# Altium project STguitar.PrjPcb (part 1 of 2)
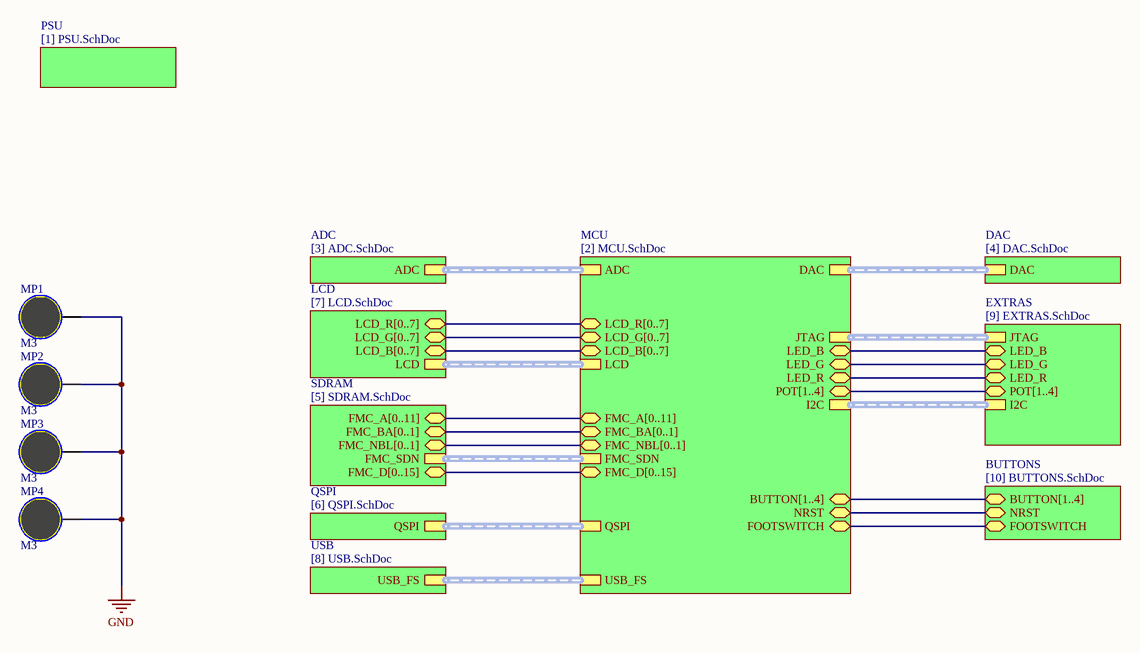
[diagram p0: [0] TOP.SchDoc]
11 sheets, 215 parts. Net scope: hierarchical (ports join the sheet entries above them; power ports are global).
Board file: STguitar.PcbDoc
Sheets:
  [0] TOP.SchDoc
    PSU = [1] PSU.SchDoc
    MCU = [2] MCU.SchDoc
    ADC = [3] ADC.SchDoc
    DAC = [4] DAC.SchDoc
    SDRAM = [5] SDRAM.SchDoc
    QSPI = [6] QSPI.SchDoc
    LCD = [7] LCD.SchDoc
    USB = [8] USB.SchDoc
    EXTRAS = [9] EXTRAS.SchDoc
    BUTTONS = [10] BUTTONS.SchDoc

## Sheet [0] TOP.SchDoc
size A4

### Parts
MP1  M3  [Mechanical screw M3]
MP2  M3  [Mechanical screw M3]
MP3  M3  [Mechanical screw M3]
MP4  M3  [Mechanical screw M3]

### Sub-sheets
ADC = [3] ADC.SchDoc: ADC (harness ADC)
BUTTONS = [10] BUTTONS.SchDoc: BUTTON[1..4] (bidir), NRST (bidir), FOOTSWITCH (bidir)
DAC = [4] DAC.SchDoc: DAC (harness DAC)
EXTRAS = [9] EXTRAS.SchDoc: JTAG (harness JTAG), LED_B (bidir), LED_G (bidir), LED_R (bidir), POT[1..4] (bidir), I2C (harness I2C)
LCD = [7] LCD.SchDoc: LCD_R[0..7] (bidir), LCD_G[0..7] (bidir), LCD_B[0..7] (bidir), LCD (harness LCD)
MCU = [2] MCU.SchDoc: BUTTON[1..4] (bidir), NRST (bidir), FOOTSWITCH (bidir), JTAG (harness JTAG), I2C (harness I2C), POT[1..4] (bidir), LED_B (bidir), LED_G (bidir), LED_R (bidir), USB_FS (harness USB), LCD (harness LCD), LCD_R[0..7] (bidir), LCD_G[0..7] (bidir), LCD_B[0..7] (bidir), QSPI (harness QSPI), FMC_NBL[0..1] (bidir), FMC_SDN (harness FMC_SDN), FMC_D[0..15] (bidir), FMC_BA[0..1] (bidir), FMC_A[0..11] (bidir), DAC (harness DAC), ADC (harness ADC)
PSU = [1] PSU.SchDoc: no entries
QSPI = [6] QSPI.SchDoc: QSPI (harness QSPI)
SDRAM = [5] SDRAM.SchDoc: FMC_A[0..11] (bidir), FMC_BA[0..1] (bidir), FMC_NBL[0..1] (bidir), FMC_SDN (harness FMC_SDN), FMC_D[0..15] (bidir)
USB = [8] USB.SchDoc: USB_FS (harness USB)

### Nets
GND: MP1.0 MP2.0 MP3.0 MP4.0
DCMI.NRST: sheet MCU/NRST, sheet BUTTONS/NRST
FOOTSWITCH: sheet MCU/FOOTSWITCH, sheet BUTTONS/FOOTSWITCH
LED_B: sheet MCU/LED_B, sheet EXTRAS/LED_B
LED_G: sheet MCU/LED_G, sheet EXTRAS/LED_G
LED_R: sheet MCU/LED_R, sheet EXTRAS/LED_R

### Buses and harness runs
bus sheet BUTTONS/BUTTON[1..4] = sheet MCU/BUTTON[1..4]
bus sheet EXTRAS/POT[1..4] = sheet MCU/POT[1..4]
bus sheet LCD/LCD_B[0..7] = sheet MCU/LCD_B[0..7]
bus sheet LCD/LCD_G[0..7] = sheet MCU/LCD_G[0..7]
bus sheet LCD/LCD_R[0..7] = sheet MCU/LCD_R[0..7]
bus sheet MCU/FMC_A[0..11] = sheet SDRAM/FMC_A[0..11]
bus sheet MCU/FMC_BA[0..1] = sheet SDRAM/FMC_BA[0..1]
bus sheet MCU/FMC_D[0..15] = sheet SDRAM/FMC_D[0..15]
bus sheet MCU/FMC_NBL[0..1] = sheet SDRAM/FMC_NBL[0..1]
harness sheet ADC/ADC = sheet MCU/ADC
harness sheet DAC/DAC = sheet MCU/DAC
harness sheet EXTRAS/I2C = sheet MCU/I2C
harness sheet EXTRAS/JTAG = sheet MCU/JTAG
harness sheet LCD/LCD = sheet MCU/LCD
harness sheet MCU/FMC_SDN = sheet SDRAM/FMC_SDN
harness sheet MCU/QSPI = sheet QSPI/QSPI
harness sheet MCU/USB_FS = sheet USB/USB_FS

### Library data of the parts
MP1-MP4 = Mechanical screw M3

## Sheet [1] PSU.SchDoc
size A4
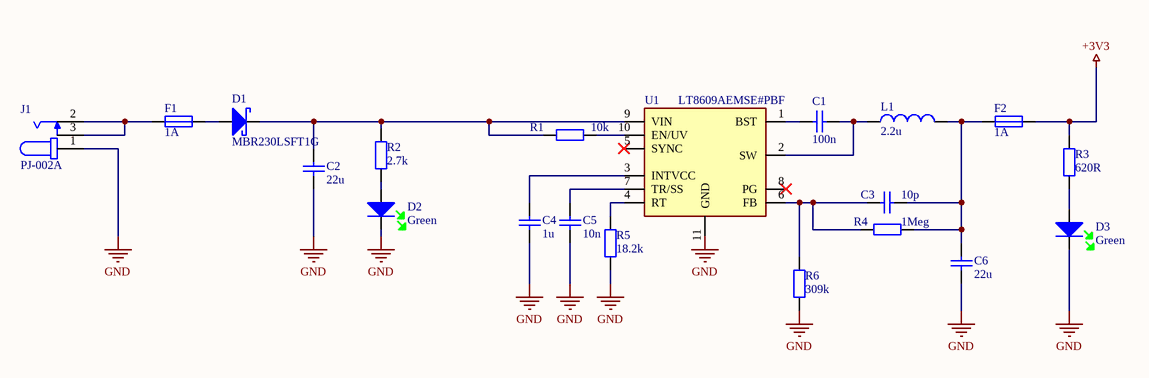
[diagram p1: [1] PSU.SchDoc]

### Parts
C1  100n  [Capacitor 0603]
C2  22u  [Capacitor 0603]
C3  10p  [Capacitor 0603]
C4  1u  [Capacitor 0603]
C5  10n  [Capacitor 0603]
C6  22u  [Capacitor 0603]
D1  MBR230LSFT1G  [Diode SOD123f]
D2  Green  [LED 0805 Green]
D3  Green  [LED 0805 Green]
F1  1A  [Fuse 1206]
F2  1A  [Fuse 1206]
J1  PJ-002A  [Mechanical CUI_PJ-002A]
L1  2.2u  [Inductor XAL50xx]
R1  10k  [Resistor 0603]
R2  2.7k  [Resistor 0603]
R3  620R  [Resistor 0603]
R4  1Meg  [Resistor 0603]
R5  18.2k  [Resistor 0603]
R6  309k  [Resistor 0603]
U1  LT8609AEMSE#PBF  [MSOP-10]

### Nets
+3V3: F2.2 R3.2
GND: C2.1 C4.1 C5.1 C6.1 D2.1 D3.1 J1.1 R5.1 R6.1 U1.11(GND)
NetC1_1: C1.1 U1.1(BST)
NetC1_2: C1.2 L1.1 U1.2(SW)
NetC2_2: C2.2 D1.2 R1.1 R2.2 U1.9(VIN)
NetC3_1: C3.1 R4.1 R6.2 U1.6(FB)
NetC3_2: C3.2 C6.2 F2.1 L1.2 R4.2
NetC4_2: C4.2 U1.3(INTVCC)
NetC5_2: C5.2 U1.7(TR/SS)
NetD1_1: D1.1 F1.2
NetD2_2: D2.2 R2.1
NetD3_2: D3.2 R3.1
NetF1_1: F1.1 J1.2 J1.3
NetR1_2: R1.2 U1.10(EN/UV)
NetR5_2: R5.2 U1.4(RT)

Not connected (* = marked no-connect by the designer): U1 5(SYNC)* 8(PG)*

### Library data of the parts
C1 = Capacitor 100n 10% 0603 EMK107B7104KA-T: Multilayer Ceramic Capacitors MLCC - SMD/SMT 0603 16VDC 0.1uF 10% X7R; Manufacturer: Taiyo Yuden; Type: SMD; Manufacturer Part Number: EMK107B7104KA-T; Footprint: 0603; Datasheet: https://pl.mouser.com/datasheet/2/396/mlcc02_e-1307760.pdf
C2 C6 = Capacitor 22u 10% 0603 CL10A226MO7JZNC: Multilayer Ceramic Capacitors MLCC - SMD/SMT 22uF+/-20% 16V X5R 1608; Manufacturer: Samsung Electro-Mechanics; Type: SMD; Manufacturer Part Number: CL10A226MO7JZNC; Footprint: 0603; Datasheet: https://pl.mouser.com/datasheet/2/585/MLCC-1837944.pdf
C3 = Capacitor 10p 10% 0603 0603YC100KAT2A: Multilayer Ceramic Capacitors MLCC - SMD/SMT 16V 10pF X7R 0603 10%; Manufacturer: AVX; Type: SMD; Manufacturer Part Number: 0603YC100KAT2A; Footprint: 0603; Datasheet: https://pl.mouser.com/datasheet/2/40/X7RDielectric-777024.pdf
C4 = Capacitor 1u 10% 0603 EMK107B7105KA-T: Multilayer Ceramic Capacitors MLCC - SMD/SMT 0603 16VDC 1uF 10% X7R; Manufacturer: Taiyo Yuden; Type: SMD; Manufacturer Part Number: EMK107B7105KA-T; Footprint: 0603; Datasheet: https://pl.mouser.com/datasheet/2/396/mlcc02_e-1307760.pdf
C5 = Capacitor 10n 10% 0603 EMK107SD103KA-T: Multilayer Ceramic Capacitors MLCC - SMD/SMT 0603 16VDC 10nF 10% Low Distort; Manufacturer: Taiyo Yuden; Type: SMD; Manufacturer Part Number: EMK107SD103KA-T; Footprint: 0603; Datasheet: https://pl.mouser.com/datasheet/2/396/mlcc02_e-1307760.pdf
D1 = Diode Schottky Diodes2A 30V SCHOTTKY MBR230LSFT1G: Schottky Diodes & Rectifiers 2A 30V SCHOTTKY; Manufacturer: ON Semiconductor / Fairchild; Type: SMD; Manufacturer Part Number: MBR230LSFT1G; Footprint: SOD-123FL-2; Datasheet: https://pl.mouser.com/datasheet/2/308/MBR230LSFT1_D-1811015.pdf
D2 D3 = Diode Standard LEDs - SMD 0805 Dome Lens LED Green- 570nm APTD2012LCGCK: Standard LEDs - SMD 0805 Dome Lens LED Green- 570nm; Manufacturer: Kingbright; Manufacturer Part Number: APTD2012LCGCK; Footprint: 0805; Type: SMD; Datasheet: https://pl.mouser.com/datasheet/2/216/APTD2012LCGCK-1102037.pdf
F1 F2 = Fuse 1206 SMT Fuse Fast Acting, 1A: Surface Mount Fuses 1206 SMT Fuse Fast Acting, 1A; Manufacturer Part Number: C1F 1; Manufacturer: Bel Fuse; Type: SMD; Footprint: 1206; Datasheet: https://pl.mouser.com/datasheet/2/643/ds-CP-c1f-series-1313112.pdf
J1 = Mechanical DC Power Connectors Power Jacks: DC Power Connectors Power Jacks; Manufacturer Part Number: PJ-002A; Manufacturer: https://pl.mouser.com/datasheet/2/670/pj_002a-1778764.pdf; Footprint: 2 mm x 6.5 mm; Type: THT; Datasheet: https://pl.mouser.com/datasheet/2/670/pj_002a-1778764.pdf
L1 = Inductor Fixed Inductors 2.2uH Shld 20% 9.2A 14.5mOhms AECQ2: Fixed Inductors 2.2uH Shld 20% 9.2A 14.5mOhms AECQ2; Manufacturer Part Number: XAL5030-222MEB; Manufacturer: Coilcraft; Type: SMD; Footprint: 5.28 mm x 3.1 mm x 5.48 mm; Datasheet: https://pl.mouser.com/datasheet/2/597/xal50xx-270657.pdf
R1 = Resistor 10k 1% 0603 RT0603FRE0710KL: Thin Film Resistors - SMD 10K ohm 1% 1/10W; Manufacturer: Yageo; Manufacturer Part Number: RT0603FRE0710KL; Footprint: 0603; Type: SMD; Datasheet: https://pl.mouser.com/datasheet/2/447/PYu_RT_1_to_0_01_RoHS_L_11-1669912.pdf
R2 = Resistor 2.7k 1% 0603 RT0603FRE072K7L: Thin Film Resistors - SMD 1/10W 2.7K ohm 1% 50ppm; Manufacturer: Yageo; Manufacturer Part Number: RT0603FRE072K7L; Footprint: 0603; Type: SMD; Datasheet: https://pl.mouser.com/datasheet/2/447/PYu_RT_1_to_0_01_RoHS_L_11-1669912.pdf
R3 = Resistor 620R 1% 0603 RT0603FRE07620RL: Thin Film Resistors - SMD 620 OHM 1% 50PPM 1/10W; Manufacturer: Yageo; Manufacturer Part Number: RT0603FRE07620RL; Footprint: 0603; Type: SMD; Datasheet: https://pl.mouser.com/datasheet/2/447/PYu_RT_1_to_0_01_RoHS_L_11-1669912.pdf
R4 = Resistor 1Meg 1% 0603 RT0603FRE071ML: Thin Film Resistors - SMD 1M OHM 1% 50PPM 1/10W; Manufacturer: Yageo; Manufacturer Part Number: RT0603FRE071ML; Footprint: 0603; Type: SMD; Datasheet: https://pl.mouser.com/datasheet/2/447/PYu_RT_1_to_0_01_RoHS_L_11-1669912.pdf
R5 = Resistor 18.2k 1% 0603 RT0603FRE0718K2L: Thin Film Resistors - SMD 1/10W 18.2K ohm 1% 50ppm; Manufacturer: Yageo; Manufacturer Part Number: RT0603FRE0718K2L; Footprint: 0603; Type: SMD; Datasheet: https://pl.mouser.com/datasheet/2/447/PYu_RT_1_to_0_01_RoHS_L_11-1669912.pdf
R6 = Resistor 309k 1% 0603 RT0603FRE07309KL: Thin Film Resistors - SMD 1/10W 309K ohm 1% 50ppm; Manufacturer: Yageo; Manufacturer Part Number: RT0603FRE07309KL; Footprint: 0603; Type: SMD; Datasheet: https://pl.mouser.com/datasheet/2/447/PYu_RT_1_to_0_01_RoHS_L_11-1669912.pdf
U1 = IC Switching Voltage Regulators 42V, 2A/3A Peak Sync Buck Reg w/ 2.5uA LT8609AEMSE#PBF: Switching Voltage Regulators 42V, 2A Synchronous Step-Down Regulator with 2.5uA Quiescent Current; Manufacturer: Analog Devices; Manufacturer Part Number: LT8609AEMSE#PBF; Type: SMD; Datasheet: https://pl.mouser.com/datasheet/2/609/LT8609_8609A_8609B-1551398.pdf

## Sheet [2] MCU.SchDoc
size A3
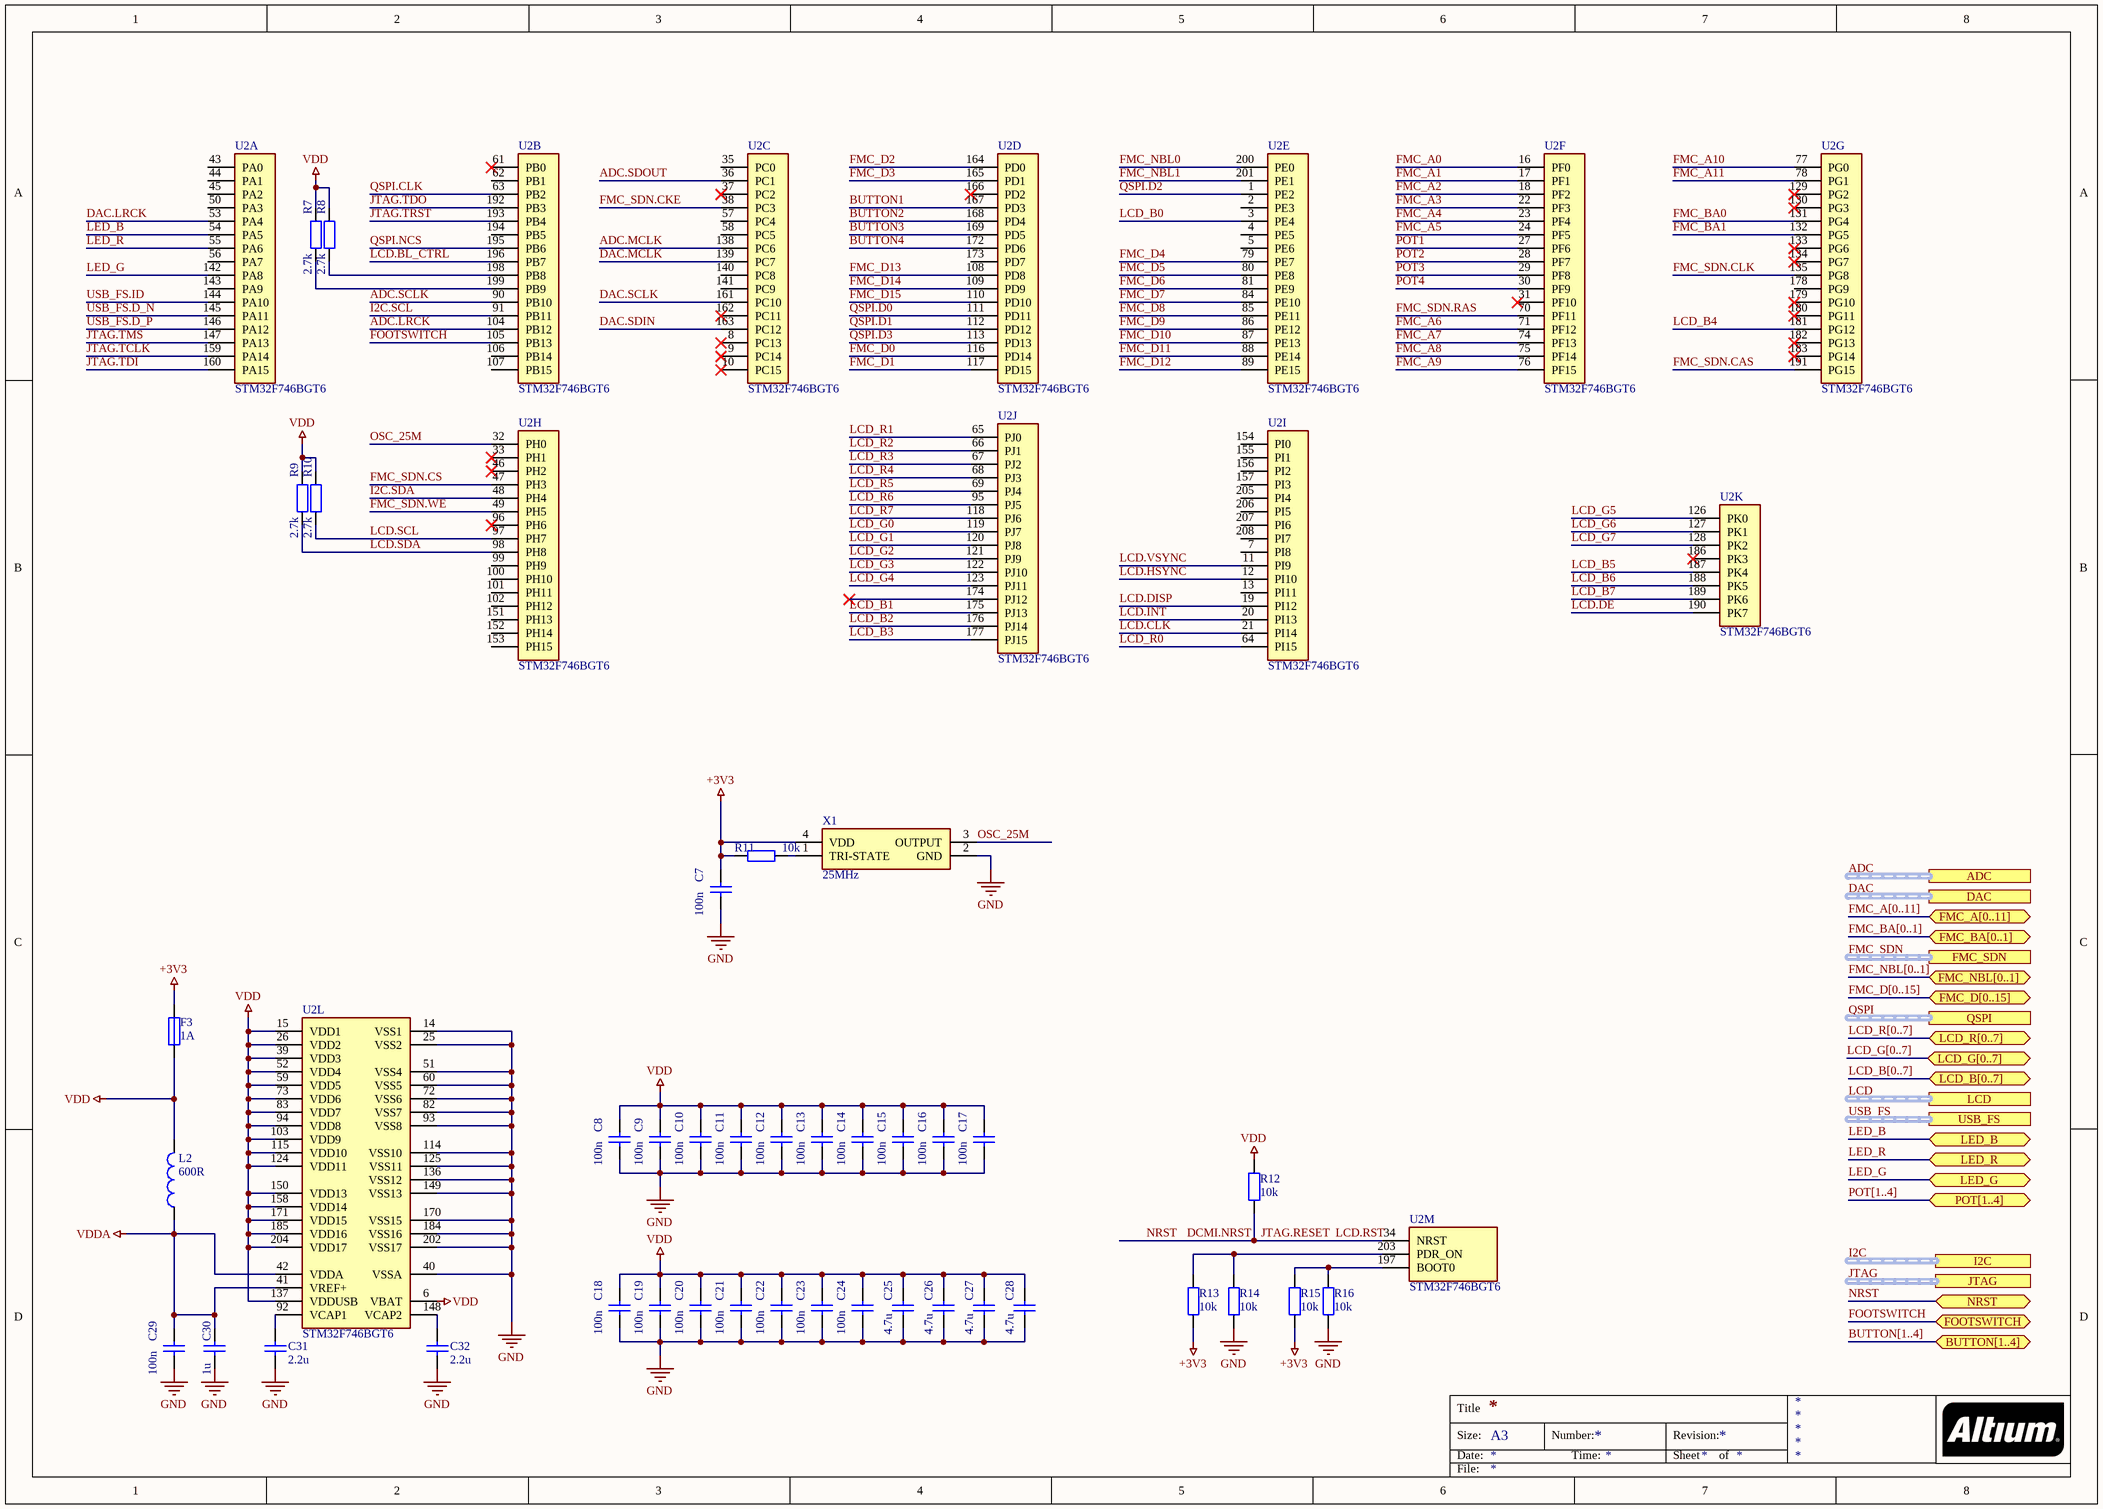
[diagram p2: [2] MCU.SchDoc]

### Parts
C7  100n  [Capacitor 0603]
C8  100n  [Capacitor 0603]
C9  100n  [Capacitor 0603]
C10  100n  [Capacitor 0603]
C11  100n  [Capacitor 0603]
C12  100n  [Capacitor 0603]
C13  100n  [Capacitor 0603]
C14  100n  [Capacitor 0603]
C15  100n  [Capacitor 0603]
C16  100n  [Capacitor 0603]
C17  100n  [Capacitor 0603]
C18  100n  [Capacitor 0603]
C19  100n  [Capacitor 0603]
C20  100n  [Capacitor 0603]
C21  100n  [Capacitor 0603]
C22  100n  [Capacitor 0603]
C23  100n  [Capacitor 0603]
C24  100n  [Capacitor 0603]
C25  4.7u  [Capacitor 0603]
C26  4.7u  [Capacitor 0603]
C27  4.7u  [Capacitor 0603]
C28  4.7u  [Capacitor 0603]
C29  100n  [Capacitor 0603]
C30  1u  [Capacitor 0603]
C31  2.2u  [Capacitor 0603]
C32  2.2u  [Capacitor 0603]
F3  1A  [Fuse 1206]
L2  600R  [Inductor 0603]
R7  2.7k  [Resistor 0603]
R8  2.7k  [Resistor 0603]
R9  2.7k  [Resistor 0603]
R10  2.7k  [Resistor 0603]
R11  10k  [Resistor 0603]
R12  10k  [Resistor 0603]
R13  10k  [Resistor 0603]
R14  10k  [Resistor 0603]
R15  10k  [Resistor 0603]
R16  10k  [Resistor 0603]
U2  STM32F746BGT6  [TQFP208]  (parts A,B,C,D,E,F,G,H,I,J,K,L,M of 13)
X1  25MHz  [Crystal 25MHz]

### Ports
ADC (harness ADC), BUTTON[1..4] (bidir), DAC (harness DAC), FMC_A[0..11] (bidir), FMC_BA[0..1] (bidir), FMC_D[0..15] (bidir), FMC_NBL[0..1] (bidir), FMC_SDN (harness FMC_SDN), FOOTSWITCH (bidir), I2C (harness I2C), JTAG (harness JTAG), LCD (harness LCD), LCD_B[0..7] (bidir), LCD_G[0..7] (bidir), LCD_R[0..7] (bidir), LED_B (bidir), LED_G (bidir), LED_R (bidir), NRST (bidir), POT[1..4] (bidir), QSPI (harness QSPI), USB_FS (harness USB)

### Nets
+3V3: C7.2 F3.2 R11.2 R13.1 R15.1 X1.4(VDD)
GND: C7.1 C8.1 C9.1 C10.1 C11.1 C12.1 C13.1 C14.1 C15.1 C16.1 C17.1 C18.1 C19.1 C20.1 C21.1 C22.1 C23.1 C24.1 C25.1 C26.1 C27.1 C28.1 C29.1 C30.1 C31.1 C32.1 R14.1 R16.1 U2.14(VSS1) U2.25(VSS2) U2.40(VSSA) U2.51(VSS4) U2.60(VSS5) U2.72(VSS6) U2.82(VSS7) U2.93(VSS8) U2.114(VSS10) U2.125(VSS11) U2.136(VSS12) U2.149(VSS13) U2.170(VSS15) U2.184(VSS16) U2.202(VSS17) X1.2(GND)
VDD: C8.2 C9.2 C10.2 C11.2 C12.2 C13.2 C14.2 C15.2 C16.2 C17.2 C18.2 C19.2 C20.2 C21.2 C22.2 C23.2 C24.2 C25.2 C26.2 C27.2 C28.2 F3.1 L2.2 R7.2 R8.2 R9.2 R10.2 R12.2 U2.6(VBAT) U2.15(VDD1) U2.26(VDD2) U2.39(VDD3) U2.52(VDD4) U2.59(VDD5) U2.73(VDD6) U2.83(VDD7) U2.94(VDD8) U2.103(VDD9) U2.115(VDD10) U2.124(VDD11) U2.137(VDDUSB) U2.150(VDD13) U2.158(VDD14) U2.171(VDD15) U2.185(VDD16) U2.204(VDD17)
VDDA: C29.2 C30.2 L2.1 U2.41(VREF+) U2.42(VDDA)
ADC.LRCK: U2.104(PB12)
ADC.MCLK: U2.138(PC6)
ADC.SCLK: U2.90(PB10)
ADC.SDOUT: U2.36(PC1)
BUTTON1: U2.167(PD3)
BUTTON2: U2.168(PD4)
BUTTON3: U2.169(PD5)
BUTTON4: U2.172(PD6)
DAC.LRCK: U2.53(PA4)
DAC.MCLK: U2.139(PC7)
DAC.SCLK: U2.161(PC10)
DAC.SDIN: U2.163(PC12)
DCMI.NRST: R12.1 U2.34(NRST) ; port NRST  [also labelled JTAG.RESET, LCD.RST, NRST]
FMC_A0: U2.16(PF0)
FMC_A1: U2.17(PF1)
FMC_A2: U2.18(PF2)
FMC_A3: U2.22(PF3)
FMC_A4: U2.23(PF4)
FMC_A5: U2.24(PF5)
FMC_A6: U2.71(PF12)
FMC_A7: U2.74(PF13)
FMC_A8: U2.75(PF14)
FMC_A9: U2.76(PF15)
FMC_A10: U2.77(PG0)
FMC_A11: U2.78(PG1)
FMC_BA0: U2.131(PG4)
FMC_BA1: U2.132(PG5)
FMC_D0: U2.116(PD14)
FMC_D1: U2.117(PD15)
FMC_D2: U2.164(PD0)
FMC_D3: U2.165(PD1)
FMC_D4: U2.79(PE7)
FMC_D5: U2.80(PE8)
FMC_D6: U2.81(PE9)
FMC_D7: U2.84(PE10)
FMC_D8: U2.85(PE11)
FMC_D9: U2.86(PE12)
FMC_D10: U2.87(PE13)
FMC_D11: U2.88(PE14)
FMC_D12: U2.89(PE15)
FMC_D13: U2.108(PD8)
FMC_D14: U2.109(PD9)
FMC_D15: U2.110(PD10)
FMC_NBL0: U2.200(PE0)
FMC_NBL1: U2.201(PE1)
FMC_SDN.CAS: U2.191(PG15)
FMC_SDN.CKE: U2.38(PC3)
FMC_SDN.CLK: U2.135(PG8)
FMC_SDN.CS: U2.47(PH3)
FMC_SDN.RAS: U2.70(PF11)
FMC_SDN.WE: U2.49(PH5)
FOOTSWITCH: U2.105(PB13) ; port FOOTSWITCH
I2C.SCL: U2.91(PB11)
I2C.SDA: U2.48(PH4)
JTAG.TCLK: U2.159(PA14)
JTAG.TDI: U2.160(PA15)
JTAG.TDO: U2.192(PB3)
JTAG.TMS: U2.147(PA13)
JTAG.TRST: U2.193(PB4)
LCD.BL_CTRL: U2.196(PB7)
LCD.CLK: U2.21(PI14)
LCD.DE: U2.190(PK7)
LCD.DISP: U2.19(PI12)
LCD.HSYNC: U2.12(PI10)
LCD.INT: U2.20(PI13)
LCD.SCL: R10.1 U2.97(PH7)
LCD.SDA: R9.1 U2.98(PH8)
LCD.VSYNC: U2.11(PI9)
LCD_B0: U2.3(PE4)
LCD_B1: U2.175(PJ13)
LCD_B2: U2.176(PJ14)
LCD_B3: U2.177(PJ15)
LCD_B4: U2.181(PG12)
LCD_B5: U2.187(PK4)
LCD_B6: U2.188(PK5)
LCD_B7: U2.189(PK6)
LCD_G0: U2.119(PJ7)
LCD_G1: U2.120(PJ8)
LCD_G2: U2.121(PJ9)
LCD_G3: U2.122(PJ10)
LCD_G4: U2.123(PJ11)
LCD_G5: U2.126(PK0)
LCD_G6: U2.127(PK1)
LCD_G7: U2.128(PK2)
LCD_R0: U2.64(PI15)
LCD_R1: U2.65(PJ0)
LCD_R2: U2.66(PJ1)
LCD_R3: U2.67(PJ2)
LCD_R4: U2.68(PJ3)
LCD_R5: U2.69(PJ4)
LCD_R6: U2.95(PJ5)
LCD_R7: U2.118(PJ6)
LED_B: U2.54(PA5) ; port LED_B
LED_G: U2.142(PA8) ; port LED_G
LED_R: U2.55(PA6) ; port LED_R
OSC_25M: U2.32(PH0) X1.3(OUTPUT)
POT1: U2.27(PF6)
POT2: U2.28(PF7)
POT3: U2.29(PF8)
POT4: U2.30(PF9)
QSPI.CLK: U2.63(PB2)
QSPI.D0: U2.111(PD11)
QSPI.D1: U2.112(PD12)
QSPI.D2: U2.1(PE2)
QSPI.D3: U2.113(PD13)
QSPI.NCS: U2.195(PB6)
USB_FS.D_N: U2.145(PA11)
USB_FS.D_P: U2.146(PA12)
USB_FS.ID: U2.144(PA10)
NetC31_2: C31.2 U2.92(VCAP1)
NetC32_2: C32.2 U2.148(VCAP2)
NetR7_1: R7.1 U2.199(PB9)
NetR8_1: R8.1 U2.198(PB8)
NetR11_1: R11.1 X1.1(TRI-STATE)
NetR13_2: R13.2 R14.2 U2.203(PDR_ON)
NetR15_2: R15.2 R16.2 U2.197(BOOT0)

Not connected (* = marked no-connect by the designer): U2 2(PE3) 4(PE5) 5(PE6) 7(PI8) 8(PC13)* 9(PC14)* 10(PC15)* 13(PI11) 31(PF10)* 33(PH1)* 35(PC0) 37(PC2)* 43(PA0) 44(PA1) 45(PA2) 46(PH2)* 50(PA3) 56(PA7) 57(PC4) 58(PC5) 61(PB0)* 62(PB1) 96(PH6)* 99(PH9) 100(PH10) 101(PH11) 102(PH12) 106(PB14) 107(PB15) 129(PG2)* 130(PG3)* 133(PG6)* 134(PG7)* 140(PC8) 141(PC9) 143(PA9) 151(PH13) 152(PH14) 153(PH15) 154(PI0) 155(PI1) 156(PI2) 157(PI3) 162(PC11)* 166(PD2)* 173(PD7) 174(PJ12)* 178(PG9) 179(PG10)* 180(PG11)* 182(PG13)* 183(PG14)* 186(PK3)* 194(PB5) 205(PI4) 206(PI5) 207(PI6) 208(PI7)

### Buses and harness runs
bus BUTTON[1..4] = port BUTTON[1..4]
bus FMC_A[0..11] = port FMC_A[0..11]
bus FMC_BA[0..1] = port FMC_BA[0..1]
bus FMC_D[0..15] = port FMC_D[0..15]
bus FMC_NBL[0..1] = port FMC_NBL[0..1]
bus LCD_B[0..7] = port LCD_B[0..7]
bus LCD_G[0..7] = port LCD_G[0..7]
bus LCD_R[0..7] = port LCD_R[0..7]
bus POT[1..4] = port POT[1..4]
harness ADC = port ADC
harness DAC = port DAC
harness FMC_SDN = port FMC_SDN
harness I2C = port I2C
harness JTAG = port JTAG
harness LCD = port LCD
harness QSPI = port QSPI
harness USB_FS = port USB_FS

### Notes on the sheet
- Title
- Size:
- Date:
- A3
- Number:
- Time:
- Revision:
- Sheet
- of
- File:

### Library data of the parts
C7-C24 C29 = Capacitor 100n 10% 0603 EMK107B7104KA-T: as C1 on sheet [1] PSU; Manufacturer Part Number: EMK107B7104KA-T; Footprint: 0603; Datasheet: https://pl.mouser.com/datasheet/2/396/mlcc02_e-1307760.pdf
C25-C28 = Capacitor 4.7u 10% 0603 EMK107ABJ475KA-T: Multilayer Ceramic Capacitors MLCC - SMD/SMT 0603 16VDC 4.7uF 10% X5R; Manufacturer: Taiyo Yuden; Type: SMD; Manufacturer Part Number: EMK107ABJ475KA-T; Footprint: 0603; Datasheet: https://pl.mouser.com/datasheet/2/396/mlcc02_e-1307760.pdf
C30 = Capacitor 1u 10% 0603 EMK107B7105KA-T: as C4 on sheet [1] PSU; Manufacturer Part Number: EMK107B7105KA-T; Footprint: 0603; Datasheet: https://pl.mouser.com/datasheet/2/396/mlcc02_e-1307760.pdf
C31 C32 = Capacitor 2.2u 10% 0603 EMK107BJ225KA-T: Multilayer Ceramic Capacitors MLCC - SMD/SMT 0603 16VDC 2.2uF 10% X5R; Manufacturer: Taiyo Yuden; Type: SMD; Manufacturer Part Number: EMK107BJ225KA-T; Footprint: 0603; Datasheet: https://pl.mouser.com/datasheet/2/396/mlcc02_e-1307760.pdf
F3 = Fuse 1206 SMT Fuse Fast Acting, 1A: as F1 on sheet [1] PSU; Footprint: 1206; Datasheet: https://pl.mouser.com/datasheet/2/643/ds-CP-c1f-series-1313112.pdf
L2 = Inductor 600R 1% 0603 HZ0603C601R-10: Ferrite Beads 600ohms 100MHz 300mA Monolithic 0603 SMD; Manufacturer: Laird Performance Materials; Manufacturer Part Number: HZ0603C601R-10; Footprint: 0603; Type: SMD; Datasheet: https://www.mouser.com/catalog/specsheets/Laird_10092020_Laird%20MCP%20Catalog-EMI%20Filtering%20and%20RF%20Inductor%20Sep%202020.pdf
R7-R10 = Resistor 2.7k 1% 0603 RT0603FRE072K7L: as R2 on sheet [1] PSU; Manufacturer Part Number: RT0603FRE072K7L; Footprint: 0603; Type: SMD; Datasheet: https://pl.mouser.com/datasheet/2/447/PYu_RT_1_to_0_01_RoHS_L_11-1669912.pdf
R11-R16 = Resistor 10k 1% 0603 RT0603FRE0710KL: as R1 on sheet [1] PSU; Manufacturer Part Number: RT0603FRE0710KL; Footprint: 0603; Type: SMD; Datasheet: https://pl.mouser.com/datasheet/2/447/PYu_RT_1_to_0_01_RoHS_L_11-1669912.pdf
U2 = IC MCU 32BIT 1MB FLASH 208LQFP STM32F746BGT6: MCU, 32BIT, CORTEX-M7, 216MHZ, LQFP-208; Architecture:ARM Cortex-M7; Program Memory Size:1MB; RAM Memory Size:320KB; CPU Speed:216MHz; No. of I/Os:168; MCU Case Style:LQFP; No. of Pins:208; Embedded Interface Type:CAN, Ethernet, I2C, SPI, UART, USART, USB; Supply Voltage Min:1.7V; Supply Voltage Max:3.6V; Packaging:Each; MSL:MSL 3 - 168 hours; Manufacturer: STMicroelectronics; Manufacturer Part Number: STM32F746BGT6; Footprint: LQFP-208; Type: SMD; Datasheet: https://pl.mouser.com/datasheet/2/389/dm00166116-1798632.pdf
X1 = Crystal 25MHz 2.5 mm x 2 mm DSC6101JA2B-025.0000: Standard Clock Oscillators Ultra-low Power MEMS Oscillator, 2520,-40C to+125C, 25ppm; Manufacturer: Microchip Technology; Manufacturer Part Number: DSC6101JA2B-025.0000; Footprint: 2.5 mm x 2 mm; Type: SMD; Datasheet: https://pl.mouser.com/datasheet/2/268/DSC61xxB-Ultra-Small-Ultra-Low-Power-MEMS-Oscillat-1660330.pdf

## Sheet [3] ADC.SchDoc
size A4
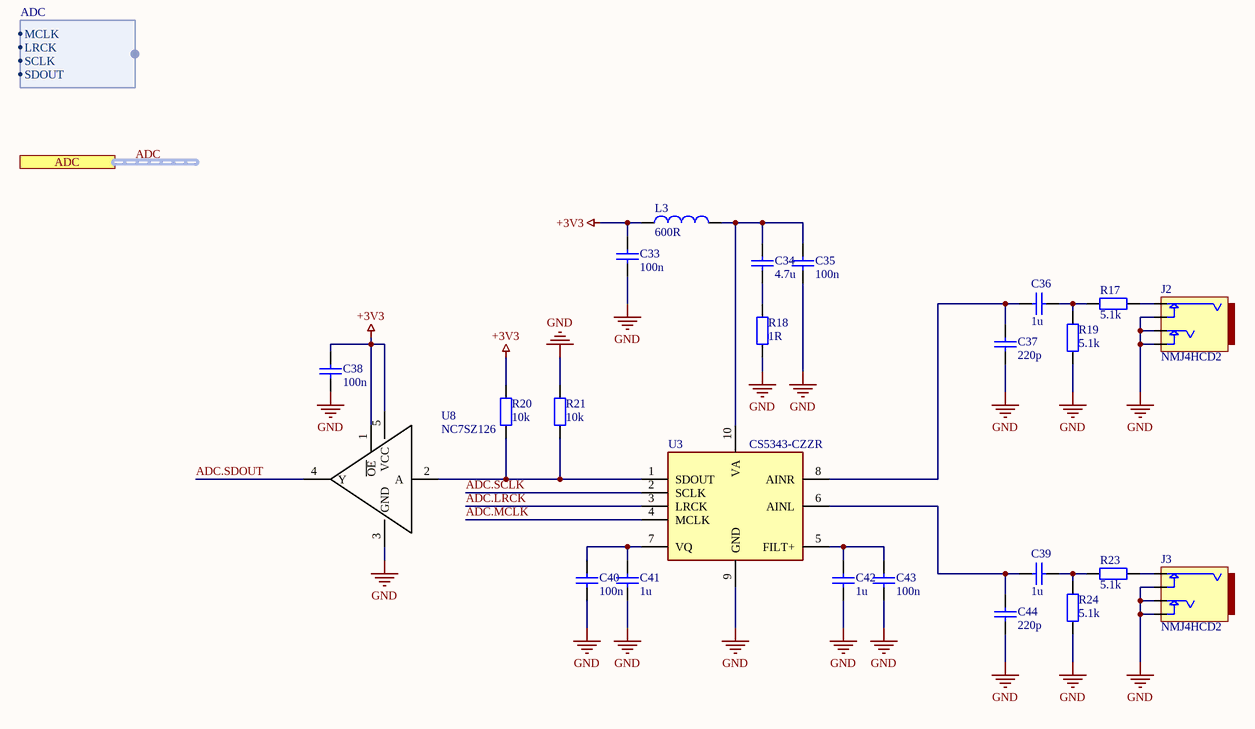
[diagram p3: [3] ADC.SchDoc]

### Parts
C33  100n  [Capacitor 0603]
C34  4.7u  [Capacitor 0603]
C35  100n  [Capacitor 0603]
C36  1u  [Capacitor 0603]
C37  220p  [Capacitor 0603]
C38  100n  [Capacitor 0603]
C39  1u  [Capacitor 0603]
C40  100n  [Capacitor 0603]
C41  1u  [Capacitor 0603]
C42  1u  [Capacitor 0603]
C43  100n  [Capacitor 0603]
C44  220p  [Capacitor 0603]
J2  NMJ4HCD2  [Mechanical NMJ4HCD2]
J3  NMJ4HCD2  [Mechanical NMJ4HCD2]
L3  600R  [Inductor 0603]
R17  5.1k  [Resistor 0603]
R18  1R  [Resistor 0603]
R19  5.1k  [Resistor 0603]
R20  10k  [Resistor 0603]
R21  10k  [Resistor 0603]
R23  5.1k  [Resistor 0603]
R24  5.1k  [Resistor 0603]
U3  CS5343-CZZR  [TSSOP10]
U8  NC7SZ126  [SC70-5]

### Ports
ADC (harness ADC)

### Harnesses
ADC: MCLK, LRCK, SCLK, SDOUT

### Nets
+3V3: C33.2 C38.2 L3.1 R20.2 U8.1(~{OE}) U8.5(VCC)
GND: C33.1 C35.1 C37.1 C38.1 C40.1 C41.1 C42.1 C43.1 C44.1 J2.1(S) J2.2(SN) J2.4(TN) J3.1(S) J3.2(SN) J3.4(TN) R18.1 R19.1 R21.2 R24.1 U3.9(GND) U8.3(GND)
ADC.LRCK: U3.3(LRCK)
ADC.MCLK: U3.4(MCLK)
ADC.SCLK: U3.2(SCLK)
ADC.SDOUT: U8.4(Y)
NetC34_1: C34.1 R18.2
NetC34_2: C34.2 C35.2 L3.2 U3.10(VA)
NetC36_1: C36.1 C37.2 U3.8(AINR)
NetC36_2: C36.2 R17.1 R19.2
NetC39_1: C39.1 C44.2 U3.6(AINL)
NetC39_2: C39.2 R23.1 R24.2
NetC40_2: C40.2 C41.2 U3.7(VQ)
NetC42_2: C42.2 C43.2 U3.5(FILT+)
NetJ2_3: J2.3(T) R17.2
NetJ3_3: J3.3(T) R23.2
NetR20_1: R20.1 R21.1 U3.1(SDOUT) U8.2(A)

### Buses and harness runs
harness ADC = port ADC

### Library data of the parts
C33 C35 C38 C40 C43 = Capacitor 100n 10% 0603 EMK107B7104KA-T: as C1 on sheet [1] PSU; Manufacturer Part Number: EMK107B7104KA-T; Footprint: 0603; Datasheet: https://pl.mouser.com/datasheet/2/396/mlcc02_e-1307760.pdf
C34 = Capacitor 4.7u 10% 0603 EMK107ABJ475KA-T: as C25 on sheet [2] MCU; Manufacturer Part Number: EMK107ABJ475KA-T; Footprint: 0603; Datasheet: https://pl.mouser.com/datasheet/2/396/mlcc02_e-1307760.pdf
C36 C39 C41 C42 = Capacitor 1u 10% 0603 EMK107B7105KA-T: as C4 on sheet [1] PSU; Manufacturer Part Number: EMK107B7105KA-T; Footprint: 0603; Datasheet: https://pl.mouser.com/datasheet/2/396/mlcc02_e-1307760.pdf
C37 C44 = Capacitor 220p 10% 0603 HMK107SD221KA-T: Multilayer Ceramic Capacitors MLCC - SMD/SMT 0603 100VDC 220pF 20% NPO MID HIGH VOL; Manufacturer: Taiyo Yuden; Type: SMD; Manufacturer Part Number: HMK107SD221KA-T; Footprint: 0603; Datasheet: https://pl.mouser.com/datasheet/2/396/mlcc06_e-1892430.pdf
J2 J3 = Mechanical JACK Phone Connectors 2C MONO 2-SPST NC: Phone Connectors 2C MONO 2-SPST NC; Manufacturer: Neutrik; Manufacturer Part Number: NMJ4HCD2; Footprint: Solder Pin; Type: THT; Datasheet: https://pl.mouser.com/datasheet/2/289/nmj4hcd2-1853956.pdf
L3 = Inductor 600R 1% 0603 HZ0603C601R-10: as L2 on sheet [2] MCU; Manufacturer Part Number: HZ0603C601R-10; Footprint: 0603; Type: SMD; Datasheet: https://www.mouser.com/catalog/specsheets/Laird_10092020_Laird%20MCP%20Catalog-EMI%20Filtering%20and%20RF%20Inductor%20Sep%202020.pdf
R17 R19 R23 R24 = Resistor 5.1k 1% 0603 RT0603FRE075K1L: Thin Film Resistors - SMD 1/10W 5.1K ohm 1% 50ppm; Manufacturer: Yageo; Manufacturer Part Number: RT0603FRE075K1L; Footprint: 0603; Type: SMD; Datasheet: https://pl.mouser.com/datasheet/2/447/PYu_RT_1_to_0_01_RoHS_L_11-1669912.pdf
R18 = Resistor 1R 1% 0603 RT0603FRE071RL: Thin Film Resistors - SMD 1/10W 1 ohm ohm 50 ppm; Manufacturer: Yageo; Manufacturer Part Number: RT0603FRE071RL; Footprint: 0603; Type: SMD; Datasheet: https://pl.mouser.com/datasheet/2/447/PYu_RT_1_to_0_01_RoHS_L_11-1669912.pdf
R20 R21 = Resistor 10k 1% 0603 RT0603FRE0710KL: as R1 on sheet [1] PSU; Manufacturer Part Number: RT0603FRE0710KL; Footprint: 0603; Type: SMD; Datasheet: https://pl.mouser.com/datasheet/2/447/PYu_RT_1_to_0_01_RoHS_L_11-1669912.pdf
U3 = IC Audio A/D Converter ICs IC 98dB 24-bit 96kHz Stereo ADC CS5343-CZZR: Audio A/D Converter ICs IC 98dB 24-bit 96kHz Stereo ADC; Manufacturer: Cirrus Logic; Manufacturer Part Number: CS5343-CZZR; Footprint: TSSOP-10; Type: SMD; Datasheet: https://pl.mouser.com/datasheet/2/76/CS5343_44_F5-1142054.pdf
U8 = IC Buffers & Line Drivers UHS Buffer NC7SZ126P5X: Buffers & Line Drivers UHS Buffer; Manufacturer: ON Semiconductor / Fairchild; Manufacturer Part Number: NC7SZ126; Footprint: SC-70-5; Type: SMD; Datasheet: https://pl.mouser.com/datasheet/2/308/NC7SZ126-D-1812272.pdf

## Sheet [4] DAC.SchDoc
size A4
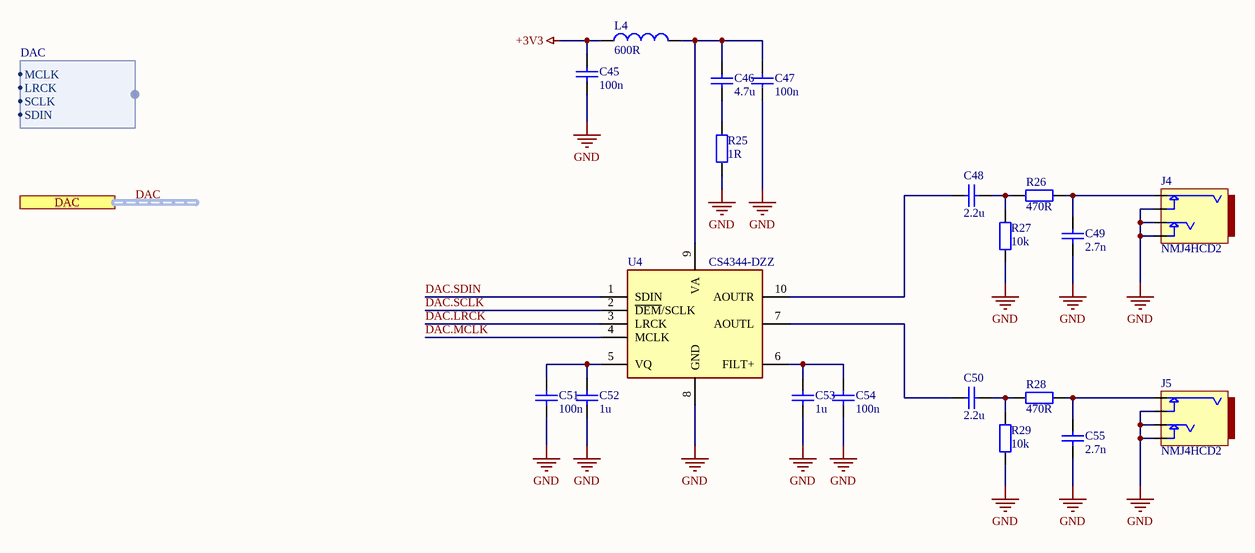
[diagram p4: [4] DAC.SchDoc]

### Parts
C45  100n  [Capacitor 0603]
C46  4.7u  [Capacitor 0603]
C47  100n  [Capacitor 0603]
C48  2.2u  [Capacitor 0603]
C49  2.7n  [Capacitor 0603]
C50  2.2u  [Capacitor 0603]
C51  100n  [Capacitor 0603]
C52  1u  [Capacitor 0603]
C53  1u  [Capacitor 0603]
C54  100n  [Capacitor 0603]
C55  2.7n  [Capacitor 0603]
J4  NMJ4HCD2  [Mechanical NMJ4HCD2]
J5  NMJ4HCD2  [Mechanical NMJ4HCD2]
L4  600R  [Inductor 0603]
R25  1R  [Resistor 0603]
R26  470R  [Resistor 0603]
R27  10k  [Resistor 0603]
R28  470R  [Resistor 0603]
R29  10k  [Resistor 0603]
U4  CS4344-DZZ  [TSSOP10]

### Ports
DAC (harness DAC)

### Harnesses
DAC: MCLK, LRCK, SCLK, SDIN

### Nets
+3V3: C45.2 L4.1
GND: C45.1 C47.1 C49.1 C51.1 C52.1 C53.1 C54.1 C55.1 J4.1(S) J4.2(SN) J4.4(TN) J5.1(S) J5.2(SN) J5.4(TN) R25.1 R27.1 R29.1 U4.8(GND)
DAC.LRCK: U4.3(LRCK)
DAC.MCLK: U4.4(MCLK)
DAC.SCLK: U4.2(~{DEM}/SCLK)
DAC.SDIN: U4.1(SDIN)
NetC46_1: C46.1 R25.2
NetC46_2: C46.2 C47.2 L4.2 U4.9(VA)
NetC48_1: C48.1 U4.10(AOUTR)
NetC48_2: C48.2 R26.1 R27.2
NetC49_2: C49.2 J4.3(T) R26.2
NetC50_1: C50.1 U4.7(AOUTL)
NetC50_2: C50.2 R28.1 R29.2
NetC51_2: C51.2 C52.2 U4.5(VQ)
NetC53_2: C53.2 C54.2 U4.6(FILT+)
NetC55_2: C55.2 J5.3(T) R28.2

### Buses and harness runs
harness DAC = port DAC

### Library data of the parts
C45 C47 C51 C54 = Capacitor 100n 10% 0603 EMK107B7104KA-T: as C1 on sheet [1] PSU; Manufacturer Part Number: EMK107B7104KA-T; Footprint: 0603; Datasheet: https://pl.mouser.com/datasheet/2/396/mlcc02_e-1307760.pdf
C46 = Capacitor 4.7u 10% 0603 EMK107ABJ475KA-T: as C25 on sheet [2] MCU; Manufacturer Part Number: EMK107ABJ475KA-T; Footprint: 0603; Datasheet: https://pl.mouser.com/datasheet/2/396/mlcc02_e-1307760.pdf
C48 C50 = Capacitor 2.2u 10% 0603 EMK107BJ225KA-T: as C31 on sheet [2] MCU; Manufacturer Part Number: EMK107BJ225KA-T; Footprint: 0603; Datasheet: https://pl.mouser.com/datasheet/2/396/mlcc02_e-1307760.pdf
C49 C55 = Capacitor 2.7n 10% 0603 UMK107SD272KA-T: Multilayer Ceramic Capacitors MLCC - SMD/SMT 0603 50VDC 2.7nF 10% Low Distort; Manufacturer: Taiyo Yuden; Type: SMD; Manufacturer Part Number: UMK107SD272KA-T; Footprint: 0603; Datasheet: https://pl.mouser.com/datasheet/2/396/mlcc02_e-1307760.pdf
C52 C53 = Capacitor 1u 10% 0603 EMK107B7105KA-T: as C4 on sheet [1] PSU; Manufacturer Part Number: EMK107B7105KA-T; Footprint: 0603; Datasheet: https://pl.mouser.com/datasheet/2/396/mlcc02_e-1307760.pdf
J4 J5 = Mechanical JACK Phone Connectors 2C MONO 2-SPST NC: as J2 on sheet [3] ADC; Manufacturer Part Number: NMJ4HCD2; Footprint: Solder Pin; Type: THT; Datasheet: https://pl.mouser.com/datasheet/2/289/nmj4hcd2-1853956.pdf
L4 = Inductor 600R 1% 0603 HZ0603C601R-10: as L2 on sheet [2] MCU; Manufacturer Part Number: HZ0603C601R-10; Footprint: 0603; Type: SMD; Datasheet: https://www.mouser.com/catalog/specsheets/Laird_10092020_Laird%20MCP%20Catalog-EMI%20Filtering%20and%20RF%20Inductor%20Sep%202020.pdf
R25 = Resistor 1R 1% 0603 RT0603FRE071RL: as R18 on sheet [3] ADC; Manufacturer Part Number: RT0603FRE071RL; Footprint: 0603; Type: SMD; Datasheet: https://pl.mouser.com/datasheet/2/447/PYu_RT_1_to_0_01_RoHS_L_11-1669912.pdf
R26 R28 = Resistor 470R 1% 0603 RT0603FRE07470RL: Thin Film Resistors - SMD 1/10W 470 ohm 1% 50ppm; Manufacturer: Yageo; Manufacturer Part Number: RT0603FRE07470RL; Footprint: 0603; Type: SMD; Datasheet: https://pl.mouser.com/datasheet/2/447/PYu_RT_1_to_0_01_RoHS_L_11-1669912.pdf
R27 R29 = Resistor 10k 1% 0603 RT0603FRE0710KL: as R1 on sheet [1] PSU; Manufacturer Part Number: RT0603FRE0710KL; Footprint: 0603; Type: SMD; Datasheet: https://pl.mouser.com/datasheet/2/447/PYu_RT_1_to_0_01_RoHS_L_11-1669912.pdf
U4 = IC Audio D/A Converter ICs Stereo DAC 24-Bit 192kHz CS4344-DZZ: Audio D/A Converter ICs Stereo DAC 24-Bit 192kHz; Manufacturer: Cirrus Logic; Manufacturer Part Number: Audio D/A Converter ICs Stereo DAC 24-Bit 192kHz; Footprint: TSSOP-10; Type: SMD; Datasheet: https://pl.mouser.com/datasheet/2/76/CS4344_45_48_F2-1141644.pdf

## Sheet [5] SDRAM.SchDoc
size A4
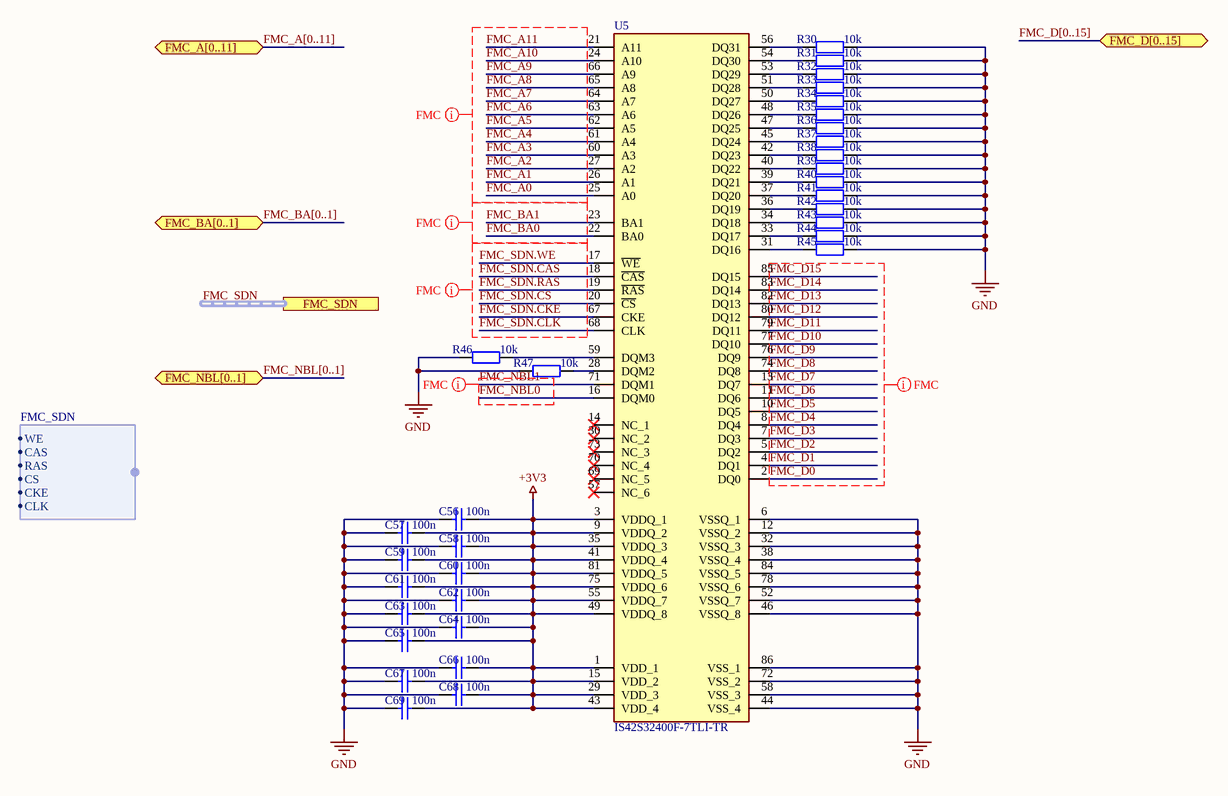
[diagram p5: [5] SDRAM.SchDoc]

### Parts
C56  100n  [Capacitor 0603]
C57  100n  [Capacitor 0603]
C58  100n  [Capacitor 0603]
C59  100n  [Capacitor 0603]
C60  100n  [Capacitor 0603]
C61  100n  [Capacitor 0603]
C62  100n  [Capacitor 0603]
C63  100n  [Capacitor 0603]
C64  100n  [Capacitor 0603]
C65  100n  [Capacitor 0603]
C66  100n  [Capacitor 0603]
C67  100n  [Capacitor 0603]
C68  100n  [Capacitor 0603]
C69  100n  [Capacitor 0603]
R30  10k  [Resistor 0603]
R31  10k  [Resistor 0603]
R32  10k  [Resistor 0603]
R33  10k  [Resistor 0603]
R34  10k  [Resistor 0603]
R35  10k  [Resistor 0603]
R36  10k  [Resistor 0603]
R37  10k  [Resistor 0603]
R38  10k  [Resistor 0603]
R39  10k  [Resistor 0603]
R40  10k  [Resistor 0603]
R41  10k  [Resistor 0603]
R42  10k  [Resistor 0603]
R43  10k  [Resistor 0603]
R44  10k  [Resistor 0603]
R45  10k  [Resistor 0603]
R46  10k  [Resistor 0603]
R47  10k  [Resistor 0603]
U5  IS42S32400F-7TLI-TR  [TSOP86]

### Ports
FMC_A[0..11] (bidir), FMC_BA[0..1] (bidir), FMC_D[0..15] (bidir), FMC_NBL[0..1] (bidir), FMC_SDN (harness FMC_SDN)

### Harnesses
FMC_SDN: CAS, WE, RAS, CS, CKE, CLK

### Nets
+3V3: C56.2 C57.2 C58.2 C59.2 C60.2 C61.2 C62.2 C63.2 C64.2 C65.2 C66.2 C67.2 C68.2 C69.2 U5.1(VDD_1) U5.3(VDDQ_1) U5.9(VDDQ_2) U5.15(VDD_2) U5.29(VDD_3) U5.35(VDDQ_3) U5.41(VDDQ_4) U5.43(VDD_4) U5.49(VDDQ_8) U5.55(VDDQ_7) U5.75(VDDQ_6) U5.81(VDDQ_5)
GND: C56.1 C57.1 C58.1 C59.1 C60.1 C61.1 C62.1 C63.1 C64.1 C65.1 C66.1 C67.1 C68.1 C69.1 R30.2 R31.2 R32.2 R33.2 R34.2 R35.2 R36.2 R37.2 R38.2 R39.2 R40.2 R41.2 R42.2 R43.2 R44.2 R45.2 R46.1 R47.1 U5.6(VSSQ_1) U5.12(VSSQ_2) U5.32(VSSQ_3) U5.38(VSSQ_4) U5.44(VSS_4) U5.46(VSSQ_8) U5.52(VSSQ_7) U5.58(VSS_3) U5.72(VSS_2) U5.78(VSSQ_6) U5.84(VSSQ_5) U5.86(VSS_1)
FMC_A0: U5.25(A0)
FMC_A1: U5.26(A1)
FMC_A2: U5.27(A2)
FMC_A3: U5.60(A3)
FMC_A4: U5.61(A4)
FMC_A5: U5.62(A5)
FMC_A6: U5.63(A6)
FMC_A7: U5.64(A7)
FMC_A8: U5.65(A8)
FMC_A9: U5.66(A9)
FMC_A10: U5.24(A10)
FMC_A11: U5.21(A11)
FMC_BA0: U5.22(BA0)
FMC_BA1: U5.23(BA1)
FMC_D0: U5.2(DQ0)
FMC_D1: U5.4(DQ1)
FMC_D2: U5.5(DQ2)
FMC_D3: U5.7(DQ3)
FMC_D4: U5.8(DQ4)
FMC_D5: U5.10(DQ5)
FMC_D6: U5.11(DQ6)
FMC_D7: U5.13(DQ7)
FMC_D8: U5.74(DQ8)
FMC_D9: U5.76(DQ9)
FMC_D10: U5.77(DQ10)
FMC_D11: U5.79(DQ11)
FMC_D12: U5.80(DQ12)
FMC_D13: U5.82(DQ13)
FMC_D14: U5.83(DQ14)
FMC_D15: U5.85(DQ15)
FMC_NBL0: U5.16(DQM0)
FMC_NBL1: U5.71(DQM1)
FMC_SDN.CAS: U5.18(~{CAS})
FMC_SDN.CKE: U5.67(CKE)
FMC_SDN.CLK: U5.68(CLK)
FMC_SDN.CS: U5.20(~{CS})
FMC_SDN.RAS: U5.19(~{RAS})
FMC_SDN.WE: U5.17(~{WE})
NetR30_1: R30.1 U5.56(DQ31)
NetR31_1: R31.1 U5.54(DQ30)
NetR32_1: R32.1 U5.53(DQ29)
NetR33_1: R33.1 U5.51(DQ28)
NetR34_1: R34.1 U5.50(DQ27)
NetR35_1: R35.1 U5.48(DQ26)
NetR36_1: R36.1 U5.47(DQ25)
NetR37_1: R37.1 U5.45(DQ24)
NetR38_1: R38.1 U5.42(DQ23)
NetR39_1: R39.1 U5.40(DQ22)
NetR40_1: R40.1 U5.39(DQ21)
NetR41_1: R41.1 U5.37(DQ20)
NetR42_1: R42.1 U5.36(DQ19)
NetR43_1: R43.1 U5.34(DQ18)
NetR44_1: R44.1 U5.33(DQ17)
NetR45_1: R45.1 U5.31(DQ16)
NetR46_2: R46.2 U5.59(DQM3)
NetR47_2: R47.2 U5.28(DQM2)

Not connected (* = marked no-connect by the designer): U5 14(NC_1)* 30(NC_2)* 57(NC_6)* 69(NC_5)* 70(NC_4)* 73(NC_3)*

### Buses and harness runs
bus FMC_A[0..11] = port FMC_A[0..11]
bus FMC_BA[0..1] = port FMC_BA[0..1]
bus FMC_D[0..15] = port FMC_D[0..15]
bus FMC_NBL[0..1] = port FMC_NBL[0..1]
harness FMC_SDN = port FMC_SDN

### Layout directives
net class FMC: FMC_A0, FMC_A1, FMC_A2, FMC_A3, FMC_A4, FMC_A5, FMC_A6, FMC_A7, FMC_A8, FMC_A9, FMC_A10, FMC_A11, FMC_BA0, FMC_BA1, FMC_D0, FMC_D1, FMC_D2, FMC_D3, FMC_D4, FMC_D5, FMC_D6, FMC_D7, FMC_D8, FMC_D9, FMC_D10, FMC_D11, FMC_D12, FMC_D13, FMC_D14, FMC_D15, FMC_NBL1, FMC_SDN.CAS, FMC_SDN.CKE, FMC_SDN.CLK, FMC_SDN.CS, FMC_SDN.RAS, FMC_SDN.WE

### Library data of the parts
C56-C69 = Capacitor 100n 10% 0603 EMK107B7104KA-T: as C1 on sheet [1] PSU; Manufacturer Part Number: EMK107B7104KA-T; Footprint: 0603; Datasheet: https://pl.mouser.com/datasheet/2/396/mlcc02_e-1307760.pdf
R30-R47 = Resistor 10k 1% 0603 RT0603FRE0710KL: as R1 on sheet [1] PSU; Manufacturer Part Number: RT0603FRE0710KL; Footprint: 0603; Type: SMD; Datasheet: https://pl.mouser.com/datasheet/2/447/PYu_RT_1_to_0_01_RoHS_L_11-1669912.pdf
U5 = IC DRAM 128M 4Mx32 143Mhz SDRAM, 3.3V IS42S32400F-7TLI-TR: DRAM 128M 4Mx32 143Mhz SDRAM, 3.3v; Manufacturer: ISSI; Manufacturer Part Number: IS42S32400F-7TLI-TR; Footprint: TSOP-86; Type: SMD; Datasheet: https://pl.mouser.com/datasheet/2/198/42-45S32400F-258273.pdf

## Sheet [6] QSPI.SchDoc
size A4
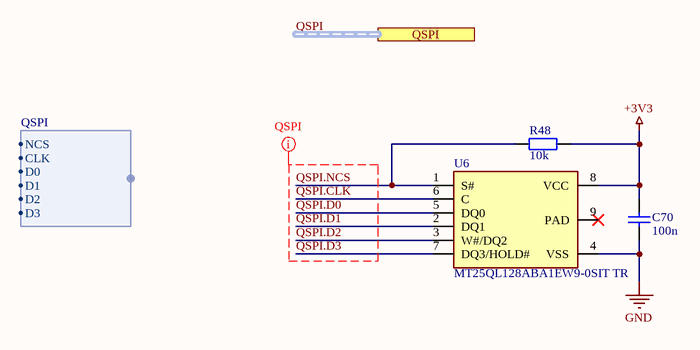
[diagram p6: [6] QSPI.SchDoc]

### Parts
C70  100n  [Capacitor 0603]
R48  10k  [Resistor 0603]
U6  MT25QL128ABA1EW9-0SIT TR  [WDFN8]

### Ports
QSPI (harness QSPI)

### Harnesses
QSPI: CLK, NCS, D0, D2, D3, D1

### Nets
+3V3: C70.2 R48.2 U6.8(VCC)
GND: C70.1 U6.4(VSS)
QSPI.CLK: U6.6(C)
QSPI.D0: U6.5(DQ0)
QSPI.D1: U6.2(DQ1)
QSPI.D2: U6.3(W#/DQ2)
QSPI.D3: U6.7(DQ3/HOLD#)
QSPI.NCS: R48.1 U6.1(S#)

Not connected (* = marked no-connect by the designer): U6 9(PAD)*

### Buses and harness runs
harness QSPI = port QSPI

### Layout directives
net class QSPI: QSPI.CLK, QSPI.D0, QSPI.D1, QSPI.D2, QSPI.D3, QSPI.NCS

### Library data of the parts
C70 = Capacitor 100n 10% 0603 EMK107B7104KA-T: as C1 on sheet [1] PSU; Manufacturer Part Number: EMK107B7104KA-T; Footprint: 0603; Datasheet: https://pl.mouser.com/datasheet/2/396/mlcc02_e-1307760.pdf
R48 = Resistor 10k 1% 0603 RT0603FRE0710KL: as R1 on sheet [1] PSU; Manufacturer Part Number: RT0603FRE0710KL; Footprint: 0603; Type: SMD; Datasheet: https://pl.mouser.com/datasheet/2/447/PYu_RT_1_to_0_01_RoHS_L_11-1669912.pdf
U6 = IC NOR Flash SPI FLASH NOR SLC 32MX4 WPDFN MT25QL128ABA1EW9-0SIT TR: NOR Flash SPI FLASH NOR SLC 32MX4 WPDFN; Manufacturer: Micron; Manufacturer Part Number: MT25QL128ABA1EW9-0SIT TR; Footprint: WDFN-8; Type: SMD; Datasheet: https://pl.mouser.com/datasheet/2/671/MT25Q_QLHS_L_128_ABA_0-1287003.pdf

## Sheet [7] LCD.SchDoc
size A4
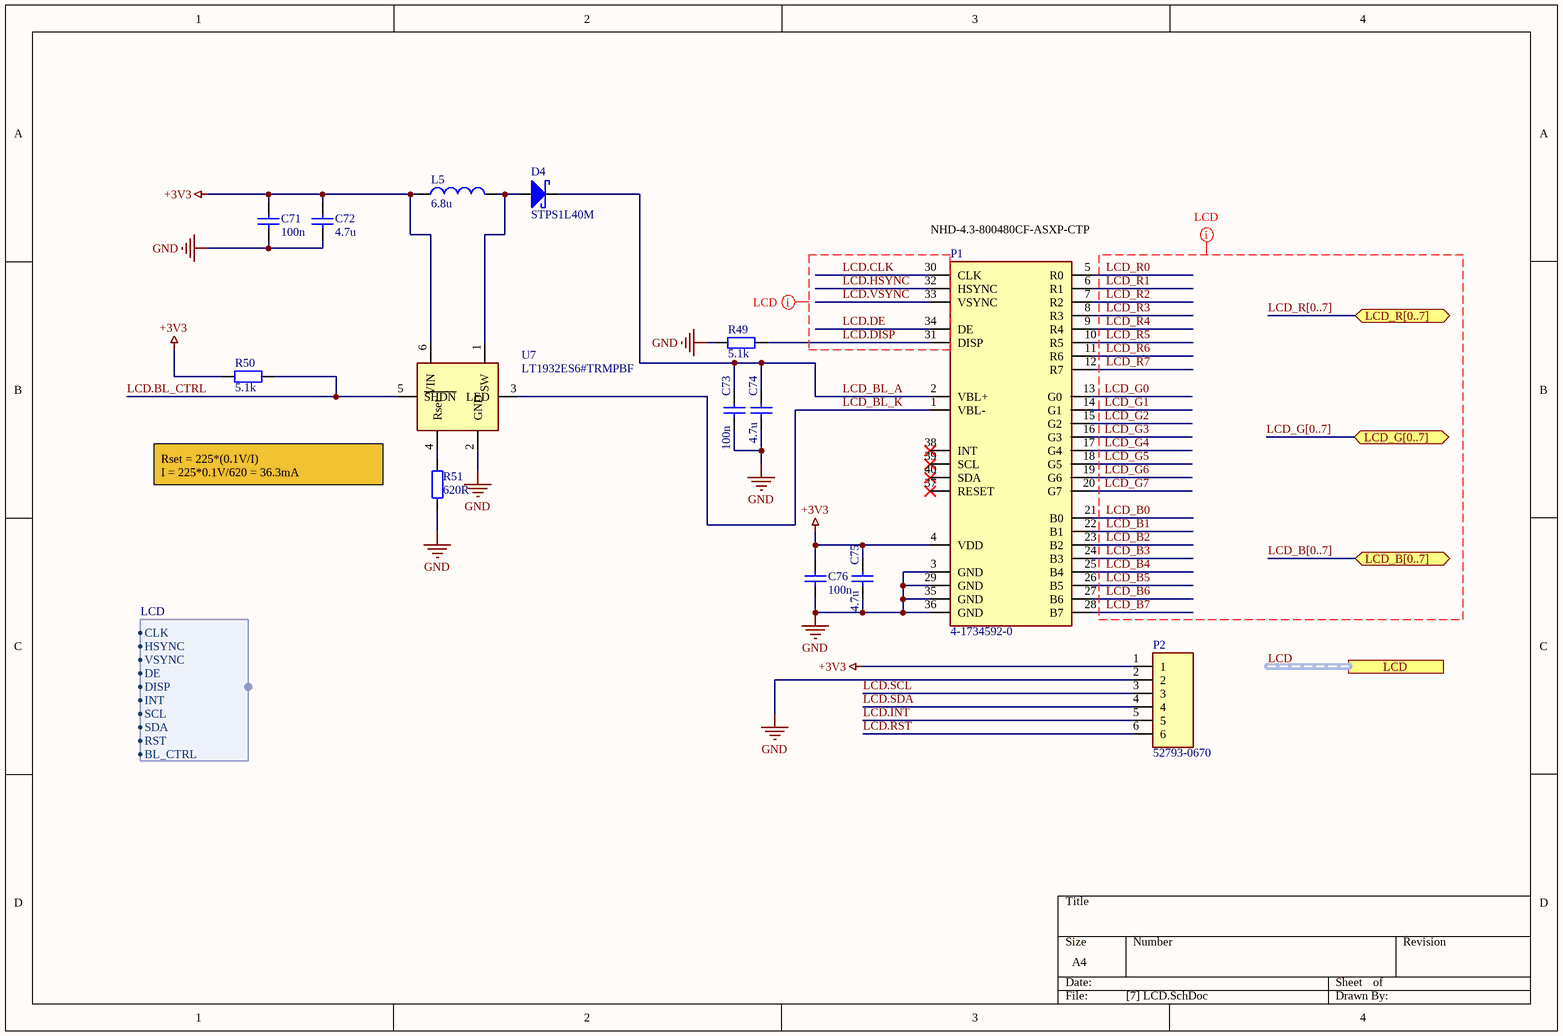
[diagram p7: [7] LCD.SchDoc]

### Parts
C71  100n  [Capacitor 0603]
C72  4.7u  [Capacitor 0603]
C73  100n  [Capacitor 0603]
C74  4.7u  [Capacitor 0603]
C75  4.7u  [Capacitor 0603]
C76  100n  [Capacitor 0603]
D4  STPS1L40M  [DO216-AA]
L5  6.8u  [Inductor ASPI]
P1  4-1734592-0  [Mechanical FFC 0.5mm 40pin]
P2  52793-0670  [Mechanical FFC 1mm 6 pin]
R49  5.1k  [Resistor 0603]
R50  5.1k  [Resistor 0603]
R51  620R  [Resistor 0603]
U7  LT1932ES6#TRMPBF  [SOT23-6]

### Ports
LCD (harness LCD), LCD_B[0..7] (bidir), LCD_G[0..7] (bidir), LCD_R[0..7] (bidir)

### Harnesses
LCD: HSYNC, CLK, VSYNC, DISP, INT, SCL, DE, SDA, RST, BL_CTRL

### Nets
+3V3: C71.2 C72.2 C75.2 C76.2 L5.1 P1.4(VDD) P2.1 R50.1 U7.6(VIN)
GND: C71.1 C72.1 C73.1 C74.1 C75.1 C76.1 P1.3(GND) P1.29(GND) P1.35(GND) P1.36(GND) P2.2 R49.1 R51.1 U7.2(GND)
LCD.BL_CTRL: R50.2 U7.5(~{SHDN})
LCD.CLK: P1.30(CLK)
LCD.DE: P1.34(DE)
LCD.DISP: P1.31(DISP) R49.2
LCD.HSYNC: P1.32(HSYNC)
LCD.INT: P2.5
LCD.RST: P2.6
LCD.SCL: P2.3
LCD.SDA: P2.4
LCD.VSYNC: P1.33(VSYNC)
LCD_B0: P1.21(B0)
LCD_B1: P1.22(B1)
LCD_B2: P1.23(B2)
LCD_B3: P1.24(B3)
LCD_B4: P1.25(B4)
LCD_B5: P1.26(B5)
LCD_B6: P1.27(B6)
LCD_B7: P1.28(B7)
LCD_BL_A: C73.2 C74.2 D4.2 P1.2(VBL+)
LCD_BL_K: P1.1(VBL-) U7.3(LED)
LCD_G0: P1.13(G0)
LCD_G1: P1.14(G1)
LCD_G2: P1.15(G2)
LCD_G3: P1.16(G3)
LCD_G4: P1.17(G4)
LCD_G5: P1.18(G5)
LCD_G6: P1.19(G6)
LCD_G7: P1.20(G7)
LCD_R0: P1.5(R0)
LCD_R1: P1.6(R1)
LCD_R2: P1.7(R2)
LCD_R3: P1.8(R3)
LCD_R4: P1.9(R4)
LCD_R5: P1.10(R5)
LCD_R6: P1.11(R6)
LCD_R7: P1.12(R7)
NetD4_1: D4.1 L5.2 U7.1(SW)
NetR51_2: R51.2 U7.4(Rset)

Not connected (* = marked no-connect by the designer): P1 37(RESET)* 38(INT)* 39(SCL)* 40(SDA)*

### Buses and harness runs
bus LCD_B[0..7] = port LCD_B[0..7]
bus LCD_G[0..7] = port LCD_G[0..7]
bus LCD_R[0..7] = port LCD_R[0..7]
harness LCD = port LCD

### Layout directives
net class LCD: LCD.CLK, LCD.DE, LCD.DISP, LCD.HSYNC, LCD.VSYNC, LCD_B0, LCD_B1, LCD_B2, LCD_B3, LCD_B4, LCD_B5, LCD_B6, LCD_B7, LCD_B[0..7], LCD_G0, LCD_G1, LCD_G2, LCD_G3, LCD_G4, LCD_G5, LCD_G6, LCD_G7, LCD_G[0..7], LCD_R0, LCD_R1, LCD_R2, LCD_R3, LCD_R4, LCD_R5, LCD_R6, LCD_R7, LCD_R[0..7]

### Notes on the sheet
- (near P1) NHD-4.3-800480CF-ASXP-CTP
- Rset = 225*(0.1V/I)
  I = 225*0.1V/620 = 36.3mA

### Library data of the parts
C71 C73 C76 = Capacitor 100n 10% 0603 EMK107B7104KA-T: as C1 on sheet [1] PSU; Manufacturer Part Number: EMK107B7104KA-T; Footprint: 0603; Datasheet: https://pl.mouser.com/datasheet/2/396/mlcc02_e-1307760.pdf
C72 C74 C75 = Capacitor 4.7u 10% 0603 EMK107ABJ475KA-T: as C25 on sheet [2] MCU; Manufacturer Part Number: EMK107ABJ475KA-T; Footprint: 0603; Datasheet: https://pl.mouser.com/datasheet/2/396/mlcc02_e-1307760.pdf
D4 = Diode Schottky Diodes & Rectifiers 1.0 Amp 40 Volt STPS1L40M: Schottky Diodes & Rectifiers 1.0 Amp 40 Volt; Manufacturer: ON Semiconductor / Fairchild; Type: SMD; Manufacturer Part Number: STPS1L40M; Footprint: DO-216AA-2; Datasheet: https://pl.mouser.com/datasheet/2/389/cd00003015-1795949.pdf
L5 = Inductor FIXED IND 6.8UH 900MA 295 MOHM ASPI-2515-6R8M-T2: Fixed Inductors FIXED IND 6.8UH 900MA 295 MOHM; Manufacturer: ABRACON; Type: SMD; Manufacturer Part Number: ASPI-2515-6R8M-T2; Footprint: 2.5 mm x 2 mm; Datasheet: https://pl.mouser.com/datasheet/2/3/ASPI_2515-1774975.pdf
P1 = Mechanical FFC & FPC Connectors FPC CONN 0.5MM PITCH B/C 40P 4-1734592-0: FFC & FPC Connectors FPC CONN 0.5MM PITCH B/C 40P; Manufacturer: TE Connectivity; Manufacturer Part Number: 4-1734592-0; Footprint: 40 Position; Type: SMD; Datasheet: https://www.te.com/commerce/DocumentDelivery/DDEController?Action=srchrtrv&DocNm=1734592&DocType=Customer+Drawing&DocLang=English&PartCntxt=4-1734592-0&DocFormat=pdf
P2 = Mechanical FFC & FPC Connectors 1.0 FFC Non ZIF HsgA ssySMT 6CktEmbsTpPkg 52793-0670: FFC & FPC Connectors 1.0 FFC Non ZIF HsgA ssySMT 6CktEmbsTpPkg; Manufacturer: Molex; Manufacturer Part Number: 52793-0670; Footprint: 6 Position; Type: SMD; Datasheet: https://pl.mouser.com/datasheet/2/276/0527930670_FFC_FPC_CONNECTORS-170651.pdf
R49 R50 = Resistor 5.1k 1% 0603 RT0603FRE075K1L: as R17 on sheet [3] ADC; Manufacturer Part Number: RT0603FRE075K1L; Footprint: 0603; Type: SMD; Datasheet: https://pl.mouser.com/datasheet/2/447/PYu_RT_1_to_0_01_RoHS_L_11-1669912.pdf
R51 = Resistor 620R 1% 0603 RT0603FRE07620RL: as R3 on sheet [1] PSU; Manufacturer Part Number: RT0603FRE07620RL; Footprint: 0603; Type: SMD; Datasheet: https://pl.mouser.com/datasheet/2/447/PYu_RT_1_to_0_01_RoHS_L_11-1669912.pdf
U7 = IC LED Lighting Drivers Boost Regulator LED Driver: LED Lighting Drivers Boost Regulator LED Driver; Manufacturer: Analog Devices; Manufacturer Part Number: LT1932ES6#TRMPBF; Footprint: SOT-23-6; Type: SMD; Datasheet: https://pl.mouser.com/datasheet/2/609/1932f-1269198.pdf

## Sheet [8] USB.SchDoc
size A4
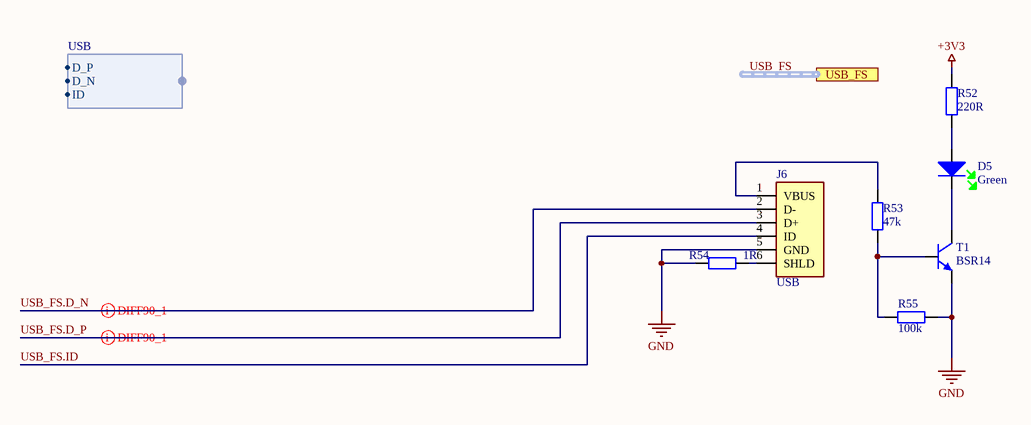
[diagram p8: [8] USB.SchDoc]

### Parts
D5  Green  [LED 0805 Green]
J6  USB  [Mechanical microUSB 47590-0001]
R52  220R  [Resistor 0603]
R53  47k  [Resistor 0603]
R54  1R  [Resistor 0603]
R55  100k  [Resistor 0603]
T1  BSR14  [SOT23-3]

### Ports
USB_FS (harness USB)

### Harnesses
USB: D_P, D_N, ID

### Nets
+3V3: R52.2
GND: J6.5(GND) R54.1 R55.2 T1.3
USB_FS.D_N: J6.2(D-)
USB_FS.D_P: J6.3(D+)
USB_FS.ID: J6.4(ID)
NetD5_1: D5.1 T1.2
NetD5_2: D5.2 R52.1
NetJ6_1: J6.1(VBUS) R53.2
NetJ6_6: J6.6(SHLD) R54.2
NetR53_1: R53.1 R55.1 T1.1

### Buses and harness runs
harness USB_FS = port USB_FS

### Layout directives
differential pair; differential pair class USB: USB_FS.D_N, USB_FS.D_P

### Library data of the parts
D5 = Diode Standard LEDs - SMD 0805 Dome Lens LED Green- 570nm APTD2012LCGCK: as D2 on sheet [1] PSU; Manufacturer Part Number: APTD2012LCGCK; Footprint: 0805; Type: SMD; Datasheet: https://pl.mouser.com/datasheet/2/216/APTD2012LCGCK-1102037.pdf
J6 = Mechanical USB Connectors MICRO USB AB RECPT RA SMT TOP MNT ASSY: USB Connectors MICRO USB AB RECPT RA SMT TOP MNT ASSY; Manufacturer Part Number: 47590-0001; Manufacturer: Molex; Footprint: 5 Contact; Type: SMD/THT; Datasheet: https://pl.mouser.com/datasheet/2/276/0475900001_IO_CONNECTORS-704847.pdf
R52 = Resistor 220R 1% 0603 RT0603FRE07220RL: Thin Film Resistors - SMD 1/10W 220 ohm 1% 50ppm; Manufacturer: Yageo; Manufacturer Part Number: RT0603FRE07220RL; Footprint: 0603; Type: SMD; Datasheet: https://pl.mouser.com/datasheet/2/447/PYu_RT_1_to_0_01_RoHS_L_11-1669912.pdf
R53 = Resistor 47k 1% 0603 RT0603FRE0747KL: Thin Film Resistors - SMD 1/10W 47K ohm 1% 50ppm; Manufacturer: Yageo; Manufacturer Part Number: RT0603FRE0747KL; Footprint: 0603; Type: SMD; Datasheet: https://pl.mouser.com/datasheet/2/447/PYu_RT_1_to_0_01_RoHS_L_11-1669912.pdf
R54 = Resistor 1R 1% 0603 RT0603FRE071RL: as R18 on sheet [3] ADC; Manufacturer Part Number: RT0603FRE071RL; Footprint: 0603; Type: SMD; Datasheet: https://pl.mouser.com/datasheet/2/447/PYu_RT_1_to_0_01_RoHS_L_11-1669912.pdf
R55 = Resistor 100k 1% 0603 RT0603FRE07100KL: Thin Film Resistors - SMD 100K ohm 1% 1/10W; Manufacturer: Yageo; Manufacturer Part Number: RT0603FRE07100KL; Footprint: 0603; Type: SMD; Datasheet: https://pl.mouser.com/datasheet/2/447/PYu_RT_1_to_0_01_RoHS_L_11-1669912.pdf
T1 = Transistor Bipolar Transistor - BJT NPN Transistor General Purpose: Bipolar Transistors - BJT NPN Transistor General Purpose; Manufacturer: ON Semiconductor / Fairchild; Type: SMD; Manufacturer Part Number: BSR14; Footprint: SOT-23-3; Datasheet: https://pl.mouser.com/datasheet/2/308/BSR14-D-1802416.pdf

## Sheet [9] EXTRAS.SchDoc
size A4
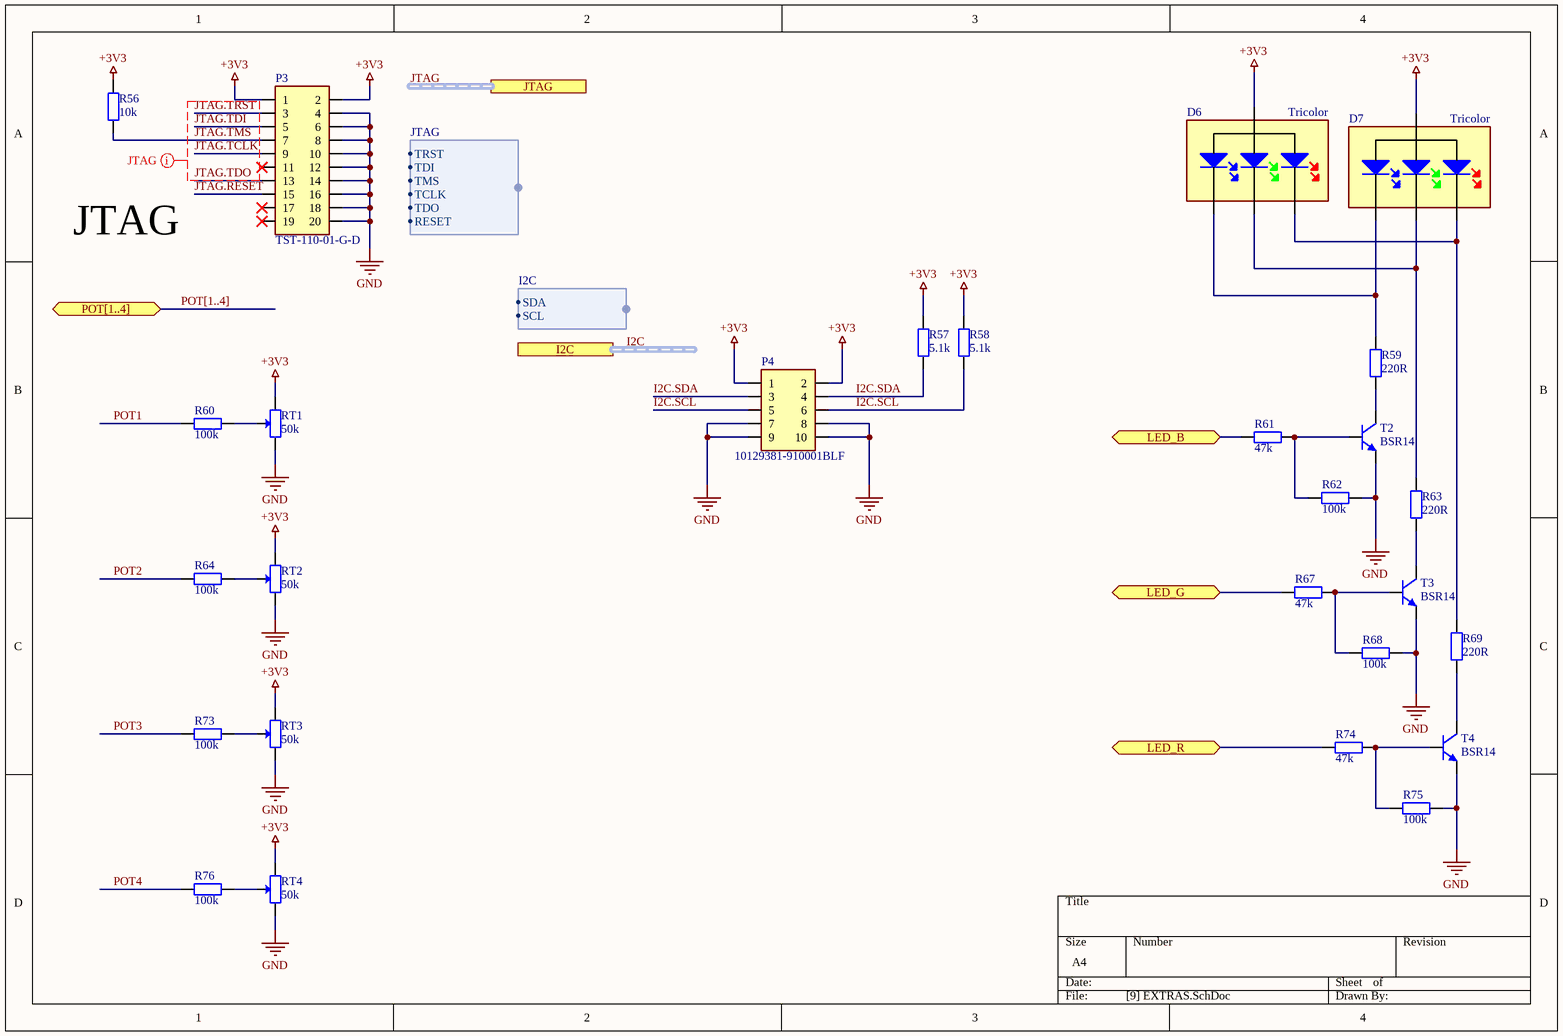
[diagram p9: [9] EXTRAS.SchDoc]

### Parts
D6  Tricolor  [LED RGB THT]
D7  Tricolor  [PLCC-4]
P3  TST-110-01-G-D  [20 pin 2.54mm male THT JTAG]
P4  10129381-910001BLF  [10 PIN THT]
R56  10k  [Resistor 0603]
R57  5.1k  [Resistor 0603]
R58  5.1k  [Resistor 0603]
R59  220R  [Resistor 0603]
R60  100k  [Resistor 0603]
R61  47k  [Resistor 0603]
R62  100k  [Resistor 0603]
R63  220R  [Resistor 0603]
R64  100k  [Resistor 0603]
R67  47k  [Resistor 0603]
R68  100k  [Resistor 0603]
R69  220R  [Resistor 0603]
R73  100k  [Resistor 0603]
R74  47k  [Resistor 0603]
R75  100k  [Resistor 0603]
R76  100k  [Resistor 0603]
RT1  50k  [PTV9]
RT2  50k  [PTV9]
RT3  50k  [PTV9]
RT4  50k  [PTV9]
T2  BSR14  [SOT23-3]
T3  BSR14  [SOT23-3]
T4  BSR14  [SOT23-3]

### Ports
I2C (harness I2C), JTAG (harness JTAG), LED_B (bidir), LED_G (bidir), LED_R (bidir), POT[1..4] (bidir)

### Harnesses
JTAG: TDI, TRST, TMS, TDO, RESET, TCLK
I2C: SDA, SCL

### Nets
+3V3: D6.2 D7.1 P3.1 P3.2 P4.1 P4.2 R56.2 R57.2 R58.2 RT1.3 RT2.3 RT3.3 RT4.3
GND: P3.4 P3.6 P3.8 P3.10 P3.12 P3.14 P3.16 P3.18 P3.20 P4.7 P4.8 P4.9 P4.10 R62.2 R68.2 R75.2 RT1.1 RT2.1 RT3.1 RT4.1 T2.3 T3.3 T4.3
I2C.SCL: P4.5 P4.6 R58.1
I2C.SDA: P4.3 P4.4 R57.1
JTAG.RESET: P3.15
JTAG.TCLK: P3.9
JTAG.TDI: P3.5
JTAG.TDO: P3.13
JTAG.TMS: P3.7 R56.1
JTAG.TRST: P3.3
LED_B: R61.2 ; port LED_B
LED_G: R67.2 ; port LED_G
LED_R: R74.2 ; port LED_R
POT1: R60.1
POT2: R64.1
POT3: R73.1
POT4: R76.1
NetD6_1: D6.1 D7.2 R69.2
NetD6_3: D6.3 D7.4 R59.2
NetD6_4: D6.4 D7.3 R63.2
NetR59_1: R59.1 T2.2
NetR60_2: R60.2 RT1.2
NetR61_1: R61.1 R62.1 T2.1
NetR63_1: R63.1 T3.2
NetR64_2: R64.2 RT2.2
NetR67_1: R67.1 R68.1 T3.1
NetR69_1: R69.1 T4.2
NetR73_2: R73.2 RT3.2
NetR74_1: R74.1 R75.1 T4.1
NetR76_2: R76.2 RT4.2

Not connected (* = marked no-connect by the designer): P3 11* 17* 19*

### Buses and harness runs
bus POT[1..4] = port POT[1..4]
harness I2C = port I2C
harness JTAG = port JTAG

### Layout directives
net class JTAG: JTAG.TCLK, JTAG.TDI, JTAG.TDO, JTAG.TMS, JTAG.TRST

### Notes on the sheet
- JTAG

### Library data of the parts
D6 = Diode Standard LEDs - Through Hole 5MM RGB LED: Standard LEDs - Through Hole 5MM RGB LED; Manufacturer Part Number: WP154A4SEJ3VBDZGC/CA; Manufacturer: Kingbright; Type: THT; Footprint: T-1 3/4 (5 mm); Datasheet: https://pl.mouser.com/datasheet/2/216/WP154A4SEJ3VBDZGC-CA-1145208.pdf
D7 = Diode Standard LEDs - SMD 2121 PLCC4 tricolor: Standard LEDs - SMD 2121 PLCC4 tricolor; Manufacturer Part Number: ASMB-LTB2-0A333; Manufacturer: Broadcom / Avago; Type: SMD; Datasheet: https://pl.mouser.com/datasheet/2/678/ASMB-LTB2-0A333-DS101-1827213.pdf
P3 = Mechanical Headers & Wire Housings .100" Shrouded Terminal Strip, Cable Mate TST-110-01-G-D: Headers & Wire Housings .100" Shrouded Terminal Strip, Cable Mate; Manufacturer: Samtec; Manufacturer Part Number: TST-110-01-G-D; Footprint: 20 Position; Type: THT; Datasheet: https://pl.mouser.com/datasheet/2/527/tst_th-1345646.pdf
P4 = Mechanical Headers & Wire Housings ECONOSTIK HEADER DR VT TH 2X5: Headers & Wire Housings ECONOSTIK HEADER DR VT TH 2X5; Manufacturer: Amphenol FCI; Manufacturer Part Number: 10129381-910001BLF; Footprint: 10 Position; Type: THT; Datasheet: https://www.amphenol-icc.com/media/wysiwyg/files/documentation/datasheet/boardwiretoboard/bwb_econostik_254headers.pdf
R56 = Resistor 10k 1% 0603 RT0603FRE0710KL: as R1 on sheet [1] PSU; Manufacturer Part Number: RT0603FRE0710KL; Footprint: 0603; Type: SMD; Datasheet: https://pl.mouser.com/datasheet/2/447/PYu_RT_1_to_0_01_RoHS_L_11-1669912.pdf
R57 R58 = Resistor 5.1k 1% 0603 RT0603FRE075K1L: as R17 on sheet [3] ADC; Manufacturer Part Number: RT0603FRE075K1L; Footprint: 0603; Type: SMD; Datasheet: https://pl.mouser.com/datasheet/2/447/PYu_RT_1_to_0_01_RoHS_L_11-1669912.pdf
R59 R63 R69 = Resistor 220R 1% 0603 RT0603FRE07220RL: as R52 on sheet [8] USB; Manufacturer Part Number: RT0603FRE07220RL; Footprint: 0603; Type: SMD; Datasheet: https://pl.mouser.com/datasheet/2/447/PYu_RT_1_to_0_01_RoHS_L_11-1669912.pdf
R60 R62 R64 R68 R73 R75 R76 = Resistor 100k 1% 0603 RT0603FRE07100KL: as R55 on sheet [8] USB; Manufacturer Part Number: RT0603FRE07100KL; Footprint: 0603; Type: SMD; Datasheet: https://pl.mouser.com/datasheet/2/447/PYu_RT_1_to_0_01_RoHS_L_11-1669912.pdf
R61 R67 R74 = Resistor 47k 1% 0603 RT0603FRE0747KL: as R53 on sheet [8] USB; Manufacturer Part Number: RT0603FRE0747KL; Footprint: 0603; Type: SMD; Datasheet: https://pl.mouser.com/datasheet/2/447/PYu_RT_1_to_0_01_RoHS_L_11-1669912.pdf
RT1-RT4 = Potentiometer PANEL CONTROL - 9MM-ST-CA 50 kohms 15 mm: PANEL CONTROL - 9MM-ST-CA 50 kohms 15 mm; Manufacturer Part Number: PTV09A-4015U-B503; Manufacturer: Bourns; Footprint: PTV09; Type: THT; Datasheet: https://pl.mouser.com/datasheet/2/54/ptv09-777818.pdf
T2-T4 = Transistor Bipolar Transistor - BJT NPN Transistor General Purpose: as T1 on sheet [8] USB; Manufacturer Part Number: BSR14; Footprint: SOT-23-3; Datasheet: https://pl.mouser.com/datasheet/2/308/BSR14-D-1802416.pdf

## Sheet [10] BUTTONS.SchDoc
size A4
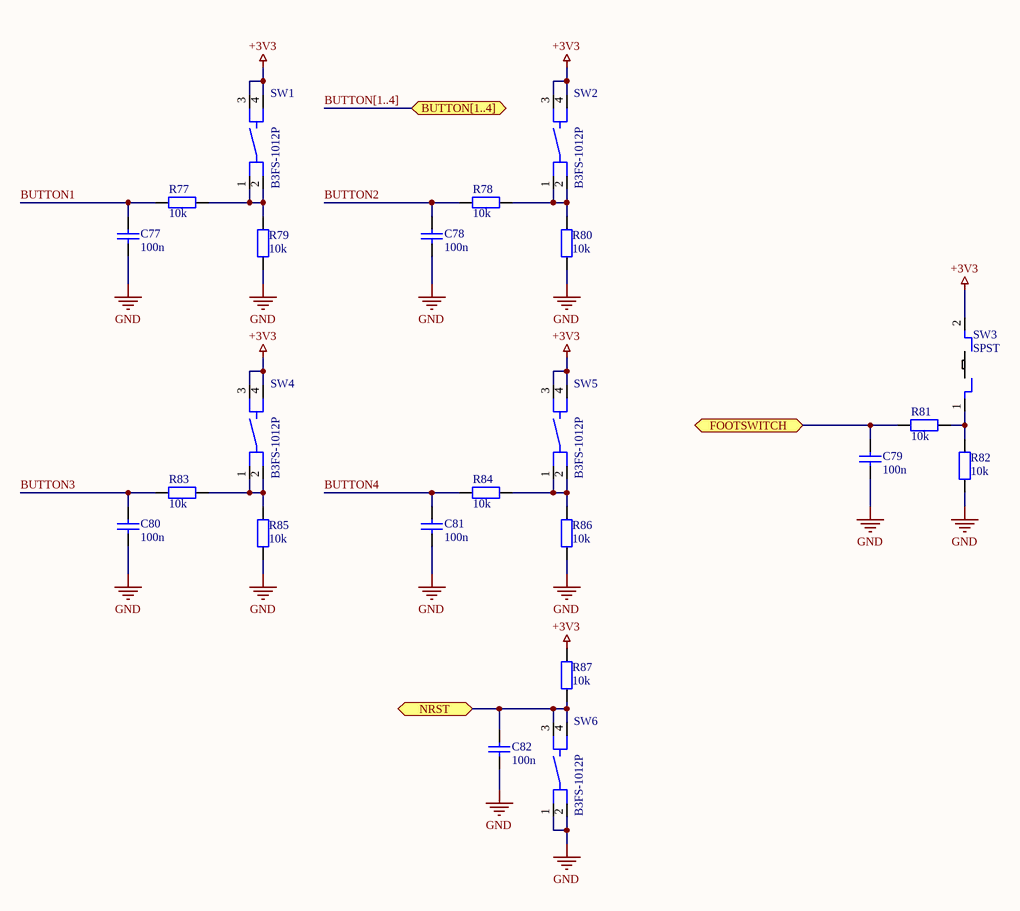
[diagram p10: [10] BUTTONS.SchDoc]

### Parts
C77  100n  [Capacitor 0603]
C78  100n  [Capacitor 0603]
C79  100n  [Capacitor 0603]
C80  100n  [Capacitor 0603]
C81  100n  [Capacitor 0603]
C82  100n  [Capacitor 0603]
R77  10k  [Resistor 0603]
R78  10k  [Resistor 0603]
R79  10k  [Resistor 0603]
R80  10k  [Resistor 0603]
R81  10k  [Resistor 0603]
R82  10k  [Resistor 0603]
R83  10k  [Resistor 0603]
R84  10k  [Resistor 0603]
R85  10k  [Resistor 0603]
R86  10k  [Resistor 0603]
R87  10k  [Resistor 0603]
SW1  B3FS-1012P  [Mechanical Tacitile 6x6]
SW2  B3FS-1012P  [Mechanical Tacitile 6x6]
SW3  SPST  [Mechanical footswitch SPST]
SW4  B3FS-1012P  [Mechanical Tacitile 6x6]
SW5  B3FS-1012P  [Mechanical Tacitile 6x6]
SW6  B3FS-1012P  [Mechanical Tacitile 6x6]

### Ports
BUTTON[1..4] (bidir), FOOTSWITCH (bidir), NRST (bidir)

### Nets
+3V3: R87.2 SW1.3 SW1.4 SW2.3 SW2.4 SW3.2 SW4.3 SW4.4 SW5.3 SW5.4
GND: C77.1 C78.1 C79.1 C80.1 C81.1 C82.1 R79.1 R80.1 R82.1 R85.1 R86.1 SW6.1 SW6.2
BUTTON1: C77.2 R77.2
BUTTON2: C78.2 R78.2
BUTTON3: C80.2 R83.2
BUTTON4: C81.2 R84.2
DCMI.NRST: C82.2 R87.1 SW6.3 SW6.4 ; port NRST
FOOTSWITCH: C79.2 R81.2 ; port FOOTSWITCH
NetR77_1: R77.1 R79.2 SW1.1 SW1.2
NetR78_1: R78.1 R80.2 SW2.1 SW2.2
NetR81_1: R81.1 R82.2 SW3.1
NetR83_1: R83.1 R85.2 SW4.1 SW4.2
NetR84_1: R84.1 R86.2 SW5.1 SW5.2

### Buses and harness runs
bus BUTTON[1..4] = port BUTTON[1..4]

### Library data of the parts
C77-C82 = Capacitor 100n 10% 0603 EMK107B7104KA-T: as C1 on sheet [1] PSU; Manufacturer Part Number: EMK107B7104KA-T; Footprint: 0603; Datasheet: https://pl.mouser.com/datasheet/2/396/mlcc02_e-1307760.pdf
R77-R87 = Resistor 10k 1% 0603 RT0603FRE0710KL: as R1 on sheet [1] PSU; Manufacturer Part Number: RT0603FRE0710KL; Footprint: 0603; Type: SMD; Datasheet: https://pl.mouser.com/datasheet/2/447/PYu_RT_1_to_0_01_RoHS_L_11-1669912.pdf
SW1 SW2 SW4-SW6 = Mechanical Tactile Switches Tactile Switch B3FS-1012P: Tactile Switches Tactile Switch; Manufacturer: Omron Electronics; Manufacturer Part Number: B3FS-1012P; Footprint: 6 mm x 6 mm; Type: SMD; Datasheet: https://pl.mouser.com/datasheet/2/307/omron_B3FS-1189765.pdf
SW3 = Mechanical Pushbutton Switches SP ON-OFF SOLDER LUG: Pushbutton Switches SP ON-OFF SOLDER LUG; Manufacturer Part Number: 64111210; Manufacturer: Carling Technologies; Footprint: THT; Type: PANEL; Datasheet: https://pl.mouser.com/datasheet/2/65/641-Series_Details__26_COS_020513-225963.pdf